# Altium project GatorSynth_Step_Sequencer.PrjPcb (part 1 of 2)
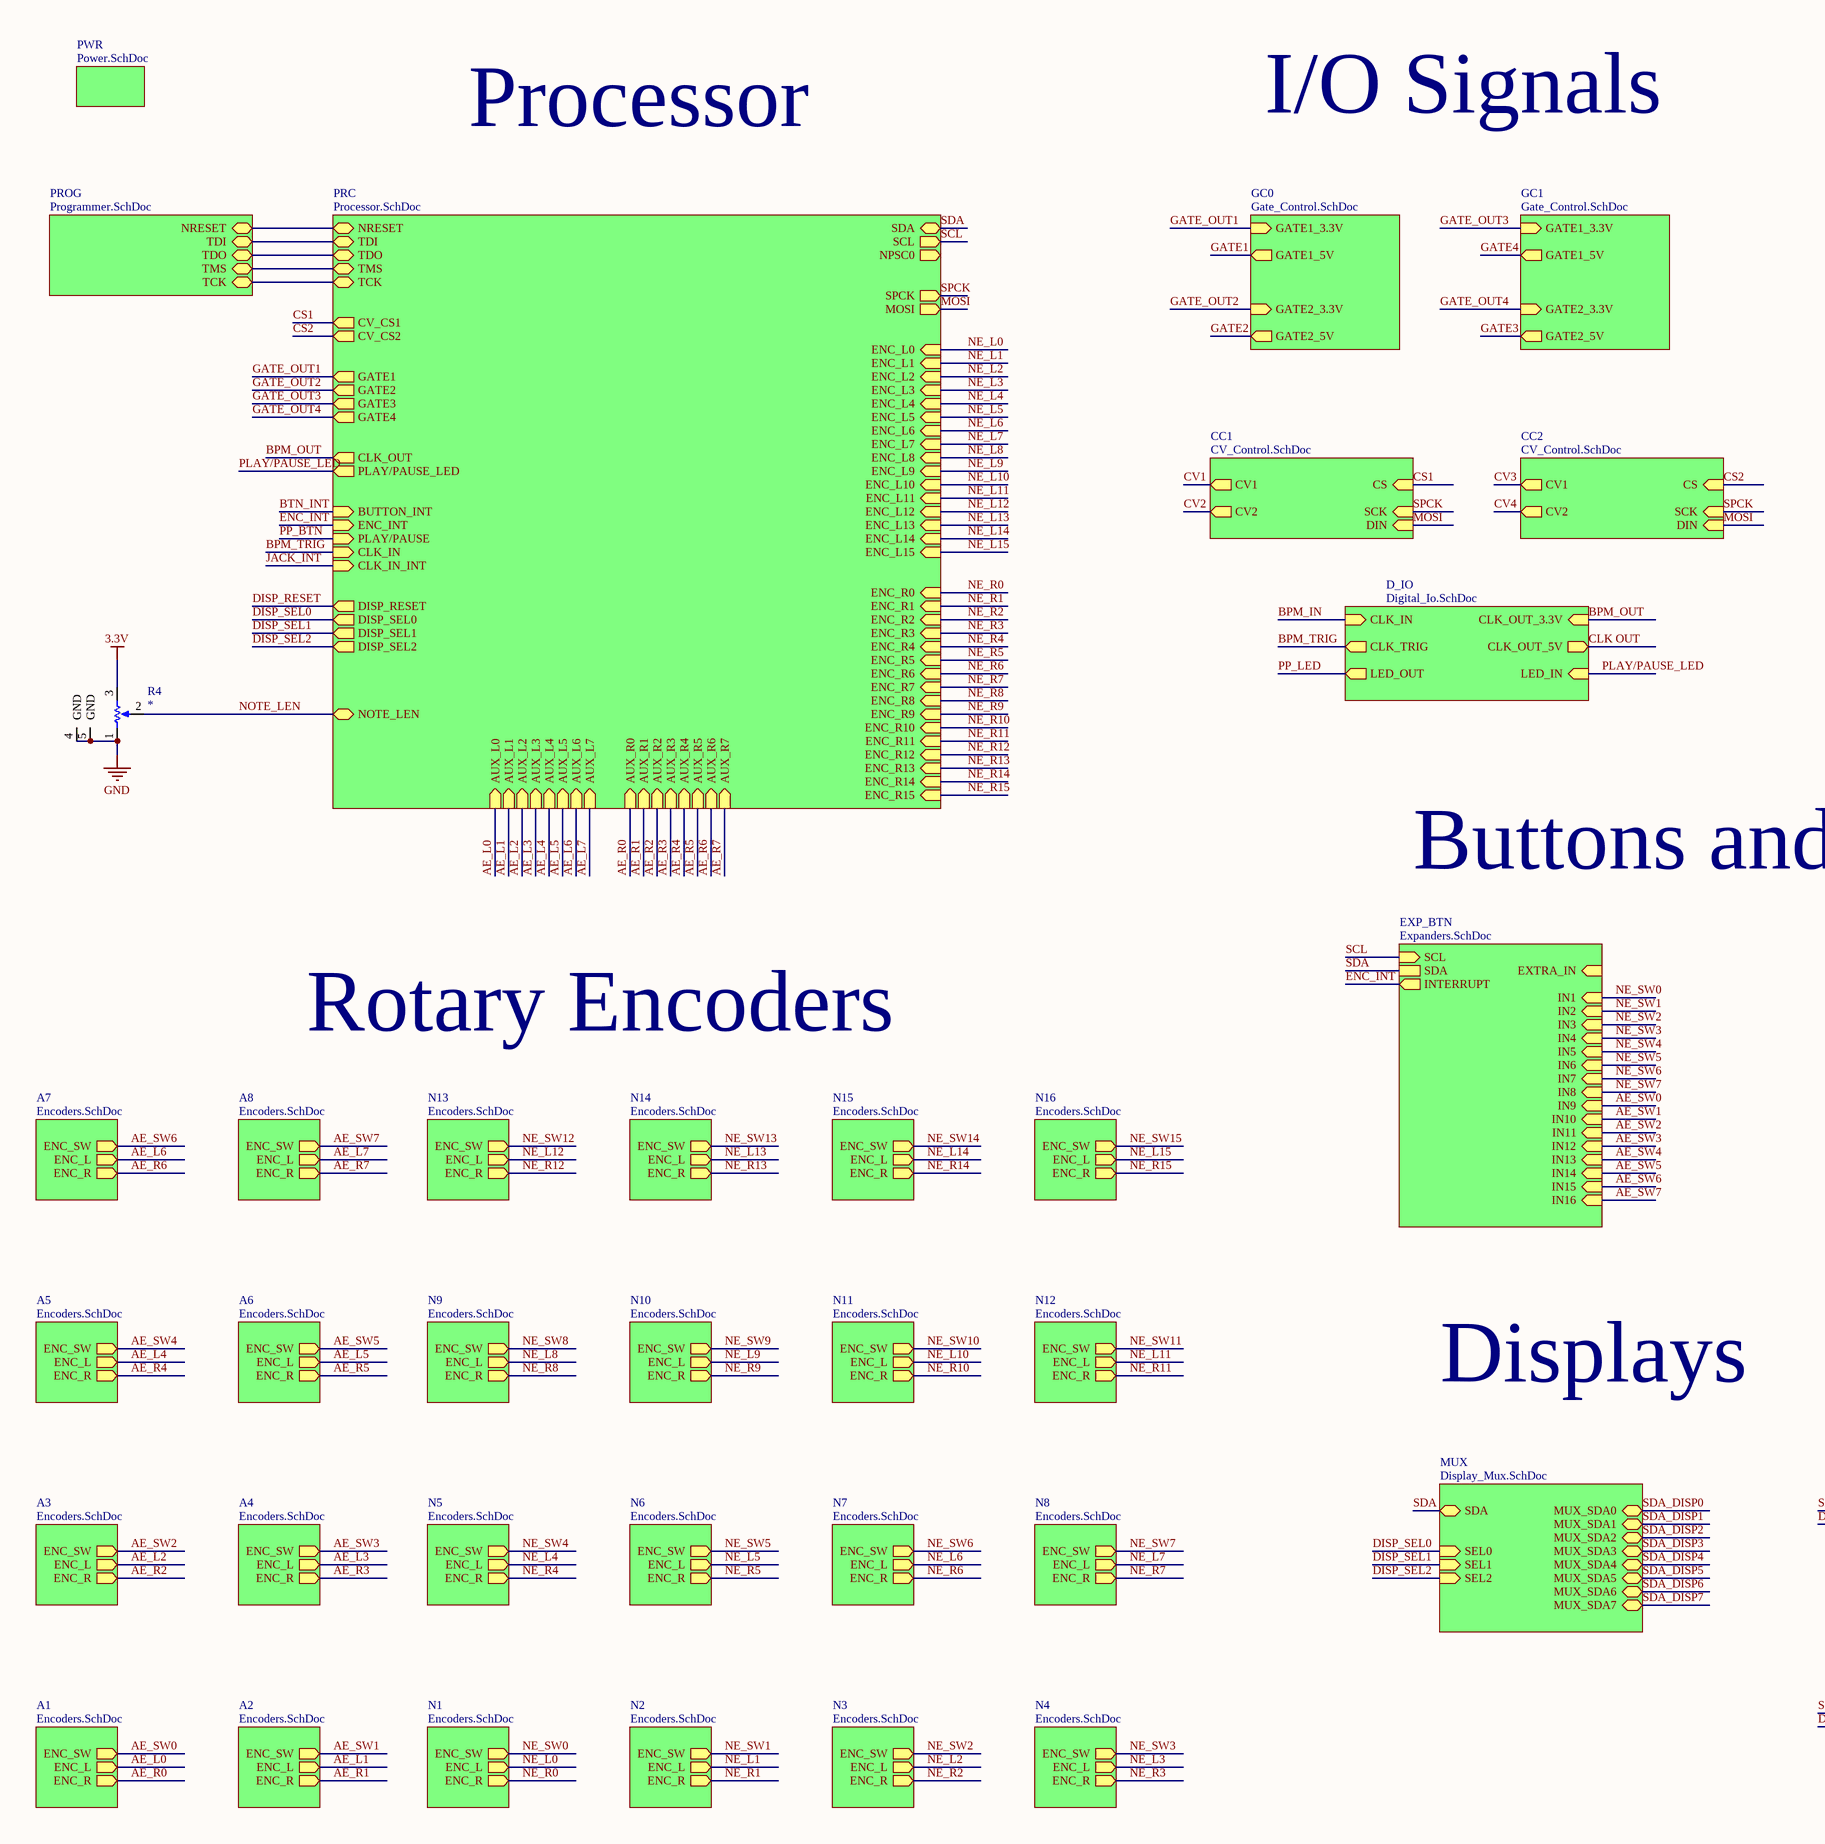
[diagram p0: Top_Level.SchDoc, left]
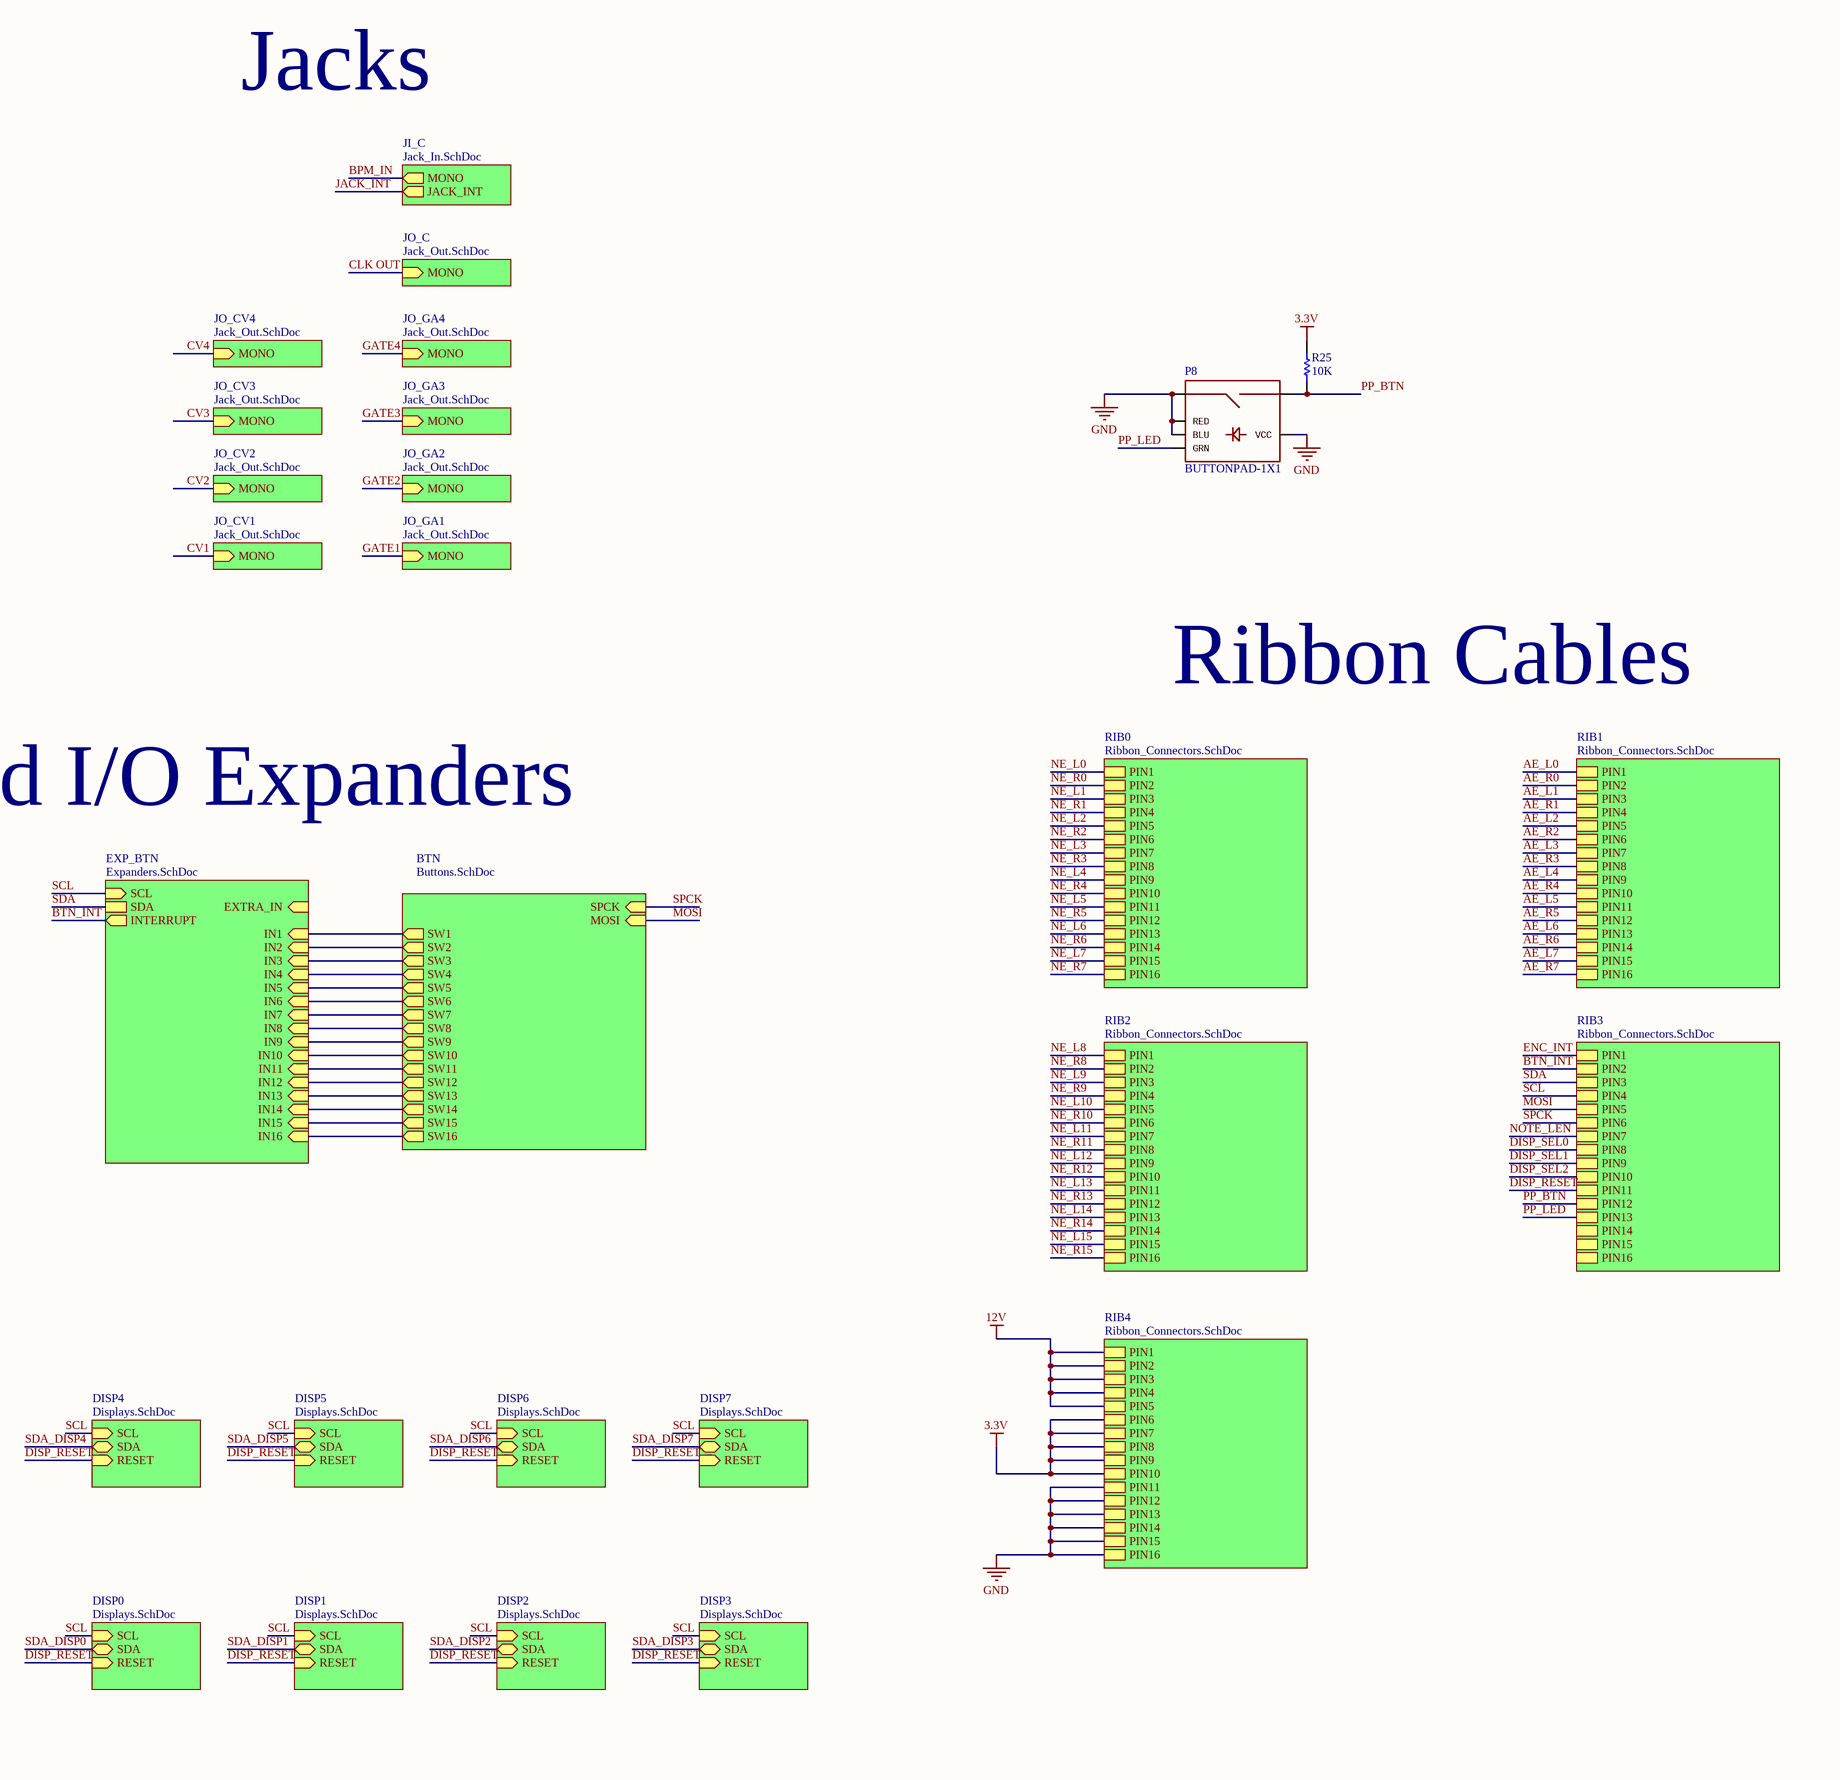
[diagram p1: Top_Level.SchDoc, right]
11 sheets, 296 parts. Net scope: hierarchical (ports join the sheet entries above them; power ports are global).
Board file: Gatorsynth_Sequencer.PcbDoc
Sheets:
  Top_Level.SchDoc
    GC1 = Gate_Control.SchDoc
    PRC = Processor.SchDoc
    JI_C = Jack_In.SchDoc
    D_IO = Digital_Io.SchDoc
    EXP_BTN = Expanders.SchDoc
    EXP_BTN = Expanders.SchDoc
    PWR = Power.SchDoc
    GC0 = Gate_Control.SchDoc
    CC1 = CV_Control.SchDoc
    CC2 = CV_Control.SchDoc
    RIB0 = Ribbon_Connectors.SchDoc
    RIB2 = Ribbon_Connectors.SchDoc
    RIB1 = Ribbon_Connectors.SchDoc
    RIB3 = Ribbon_Connectors.SchDoc
    RIB4 = Ribbon_Connectors.SchDoc
    DISP0 = Displays.SchDoc
    DISP1 = Displays.SchDoc
    DISP2 = Displays.SchDoc
    DISP3 = Displays.SchDoc
    DISP4 = Displays.SchDoc
    DISP5 = Displays.SchDoc
    DISP6 = Displays.SchDoc
    DISP7 = Displays.SchDoc
    A1 = Encoders.SchDoc
    A2 = Encoders.SchDoc
    A3 = Encoders.SchDoc
    A4 = Encoders.SchDoc
    A5 = Encoders.SchDoc
    A6 = Encoders.SchDoc
    A7 = Encoders.SchDoc
    A8 = Encoders.SchDoc
    N1 = Encoders.SchDoc
    N2 = Encoders.SchDoc
    N3 = Encoders.SchDoc
    N4 = Encoders.SchDoc
    N5 = Encoders.SchDoc
    N6 = Encoders.SchDoc
    N7 = Encoders.SchDoc
    N8 = Encoders.SchDoc
    N9 = Encoders.SchDoc
    N10 = Encoders.SchDoc
    N11 = Encoders.SchDoc
    N12 = Encoders.SchDoc
    N13 = Encoders.SchDoc
    N14 = Encoders.SchDoc
    N15 = Encoders.SchDoc
    N16 = Encoders.SchDoc

## Sheet Top_Level.SchDoc
size D

### Parts
P8  BUTTONPAD-1X1  [BUTTONPAD-1X1]
R4  *  [Potentiometer (NO SLOT)]
R25  value 10K  [AXIAL-0.3]  (hidden comment: R3)

### Sub-sheets
A1 = Encoders.SchDoc: ENC_SW (out), ENC_L (out), ENC_R (out)
A2 = Encoders.SchDoc: ENC_SW (out), ENC_L (out), ENC_R (out)
A3 = Encoders.SchDoc: ENC_SW (out), ENC_L (out), ENC_R (out)
A4 = Encoders.SchDoc: ENC_SW (out), ENC_L (out), ENC_R (out)
A5 = Encoders.SchDoc: ENC_SW (out), ENC_L (out), ENC_R (out)
A6 = Encoders.SchDoc: ENC_SW (out), ENC_L (out), ENC_R (out)
A7 = Encoders.SchDoc: ENC_SW (out), ENC_L (out), ENC_R (out)
A8 = Encoders.SchDoc: ENC_SW (out), ENC_L (out), ENC_R (out)
BTN = Buttons.SchDoc (file not in this document): SPCK (in), MOSI (in), SW1 (out), SW2 (out), SW3 (out), SW4 (out), SW5 (out), SW6 (out), SW7 (out), SW8 (out), SW9 (out), SW10 (out), SW11 (out), SW12 (out), SW13 (out), SW14 (out), SW15 (out), SW16 (out)
CC1 = CV_Control.SchDoc: CS (in), SCK (in), DIN (in), CV1 (out), CV2 (out)
CC2 = CV_Control.SchDoc: CS (in), SCK (in), DIN (in), CV1 (out), CV2 (out)
D_IO = Digital_Io.SchDoc: CLK_IN (in), CLK_TRIG (out), LED_IN (in), CLK_OUT_3.3V (in), CLK_OUT_5V (out), LED_OUT (out)
DISP0 = Displays.SchDoc: SCL (in), SDA (bidir), RESET (in)
DISP1 = Displays.SchDoc: SCL (in), SDA (bidir), RESET (in)
DISP2 = Displays.SchDoc: SCL (in), SDA (bidir), RESET (in)
DISP3 = Displays.SchDoc: SCL (in), SDA (bidir), RESET (in)
DISP4 = Displays.SchDoc: SCL (in), SDA (bidir), RESET (in)
DISP5 = Displays.SchDoc: SCL (in), SDA (bidir), RESET (in)
DISP6 = Displays.SchDoc: SCL (in), SDA (bidir), RESET (in)
DISP7 = Displays.SchDoc: SCL (in), SDA (bidir), RESET (in)
EXP_BTN = Expanders.SchDoc: SCL (in), SDA, EXTRA_IN (in), INTERRUPT (out), IN1 (in), IN2 (in), IN3 (in), IN4 (in), IN5 (in), IN6 (in), IN7 (in), IN8 (in), IN9 (in), IN10 (in), IN11 (in), IN12 (in), IN13 (in), IN14 (in), IN15 (in), IN16 (in)
EXP_BTN = Expanders.SchDoc: SCL (in), SDA, EXTRA_IN (in), INTERRUPT (out), IN1 (in), IN2 (in), IN3 (in), IN4 (in), IN5 (in), IN6 (in), IN7 (in), IN8 (in), IN9 (in), IN10 (in), IN11 (in), IN12 (in), IN13 (in), IN14 (in), IN15 (in), IN16 (in)
GC0 = Gate_Control.SchDoc: GATE1_3.3V (in), GATE2_3.3V (in), GATE1_5V (out), GATE2_5V (out)
GC1 = Gate_Control.SchDoc: GATE1_3.3V (in), GATE2_3.3V (in), GATE1_5V (out), GATE2_5V (out)
JI_C = Jack_In.SchDoc: MONO (out), JACK_INT (out)
JO_C = Jack_Out.SchDoc (file not in this document): MONO (in)
JO_CV1 = Jack_Out.SchDoc (file not in this document): MONO (in)
JO_CV2 = Jack_Out.SchDoc (file not in this document): MONO (in)
JO_CV3 = Jack_Out.SchDoc (file not in this document): MONO (in)
JO_CV4 = Jack_Out.SchDoc (file not in this document): MONO (in)
JO_GA1 = Jack_Out.SchDoc (file not in this document): MONO (in)
JO_GA2 = Jack_Out.SchDoc (file not in this document): MONO (in)
JO_GA3 = Jack_Out.SchDoc (file not in this document): MONO (in)
JO_GA4 = Jack_Out.SchDoc (file not in this document): MONO (in)
MUX = Display_Mux.SchDoc (file not in this document): SEL1 (in), SEL2 (in), MUX_SDA0 (bidir), MUX_SDA1 (bidir), MUX_SDA2 (bidir), MUX_SDA3 (bidir), MUX_SDA4 (bidir), MUX_SDA5 (bidir), MUX_SDA6 (bidir), MUX_SDA7 (bidir), SDA (bidir), SEL0 (in)
N1 = Encoders.SchDoc: ENC_SW (out), ENC_L (out), ENC_R (out)
N2 = Encoders.SchDoc: ENC_SW (out), ENC_L (out), ENC_R (out)
N3 = Encoders.SchDoc: ENC_SW (out), ENC_L (out), ENC_R (out)
N4 = Encoders.SchDoc: ENC_SW (out), ENC_L (out), ENC_R (out)
N5 = Encoders.SchDoc: ENC_SW (out), ENC_L (out), ENC_R (out)
N6 = Encoders.SchDoc: ENC_SW (out), ENC_L (out), ENC_R (out)
N7 = Encoders.SchDoc: ENC_SW (out), ENC_L (out), ENC_R (out)
N8 = Encoders.SchDoc: ENC_SW (out), ENC_L (out), ENC_R (out)
N9 = Encoders.SchDoc: ENC_SW (out), ENC_L (out), ENC_R (out)
N10 = Encoders.SchDoc: ENC_SW (out), ENC_L (out), ENC_R (out)
N11 = Encoders.SchDoc: ENC_SW (out), ENC_L (out), ENC_R (out)
N12 = Encoders.SchDoc: ENC_SW (out), ENC_L (out), ENC_R (out)
N13 = Encoders.SchDoc: ENC_SW (out), ENC_L (out), ENC_R (out)
N14 = Encoders.SchDoc: ENC_SW (out), ENC_L (out), ENC_R (out)
N15 = Encoders.SchDoc: ENC_SW (out), ENC_L (out), ENC_R (out)
N16 = Encoders.SchDoc: ENC_SW (out), ENC_L (out), ENC_R (out)
PRC = Processor.SchDoc: MOSI (out), SPCK (out), NPSC0 (out), SDA (bidir), SCL (out), NRESET (bidir), TDI (bidir), TDO (bidir), TMS (bidir), TCK (bidir), GATE1 (out), GATE2 (out), GATE3 (out), GATE4 (out), BUTTON_INT (in), ENC_INT (in), PLAY/PAUSE (in), CLK_IN (in), CLK_IN_INT (in), CLK_OUT (out), DISP_RESET (out), PLAY/PAUSE_LED (out), CV_CS2 (out), CV_CS1 (out), AUX_L0 (in), AUX_L1 (in), AUX_L2 (in), AUX_L3 (in), AUX_L4 (in), AUX_L5 (in), AUX_L6 (in), AUX_L7 (in), AUX_R0 (in), AUX_R1 (in), AUX_R2 (in), AUX_R3 (in), AUX_R4 (in), AUX_R5 (in), AUX_R6 (in), AUX_R7 (in), DISP_SEL0 (out), DISP_SEL1 (out), DISP_SEL2 (out), ENC_L0 (in), ENC_L1 (in), ENC_L2 (in), ENC_L3 (in), ENC_L4 (in), ENC_L5 (in), ENC_L6 (in), ENC_L7 (in), ENC_L8 (in), ENC_L9 (in), ENC_L10 (in), ENC_L11 (in), ENC_L12 (in), ENC_L13 (in), ENC_L14 (in), ENC_L15 (in), ENC_R0 (in), ENC_R1 (in), ENC_R2 (in), ENC_R3 (in), ENC_R4 (in), ENC_R5 (in), ENC_R6 (in), ENC_R7 (in), ENC_R8 (in), ENC_R9 (in), ENC_R10 (in), ENC_R11 (in), ENC_R12 (in), ENC_R13 (in), ENC_R14 (in), ENC_R15 (in), NOTE_LEN
PROG = Programmer.SchDoc (file not in this document): TMS (bidir), TCK (bidir), TDO (bidir), TDI (bidir), NRESET (bidir)
PWR = Power.SchDoc: no entries
RIB0 = Ribbon_Connectors.SchDoc: PIN1, PIN2, PIN3, PIN4, PIN5, PIN6, PIN7, PIN8, PIN9, PIN10, PIN11, PIN12, PIN13, PIN14, PIN15, PIN16
RIB1 = Ribbon_Connectors.SchDoc: PIN1, PIN2, PIN3, PIN4, PIN5, PIN6, PIN7, PIN8, PIN9, PIN10, PIN11, PIN12, PIN13, PIN14, PIN15, PIN16
RIB2 = Ribbon_Connectors.SchDoc: PIN1, PIN2, PIN3, PIN4, PIN5, PIN6, PIN7, PIN8, PIN9, PIN10, PIN11, PIN12, PIN13, PIN14, PIN15, PIN16
RIB3 = Ribbon_Connectors.SchDoc: PIN1, PIN2, PIN3, PIN4, PIN5, PIN6, PIN7, PIN8, PIN9, PIN10, PIN11, PIN12, PIN13, PIN14, PIN15, PIN16
RIB4 = Ribbon_Connectors.SchDoc: PIN1, PIN2, PIN3, PIN4, PIN5, PIN6, PIN7, PIN8, PIN9, PIN10, PIN11, PIN12, PIN13, PIN14, PIN15, PIN16

### Nets
3.3V: R4.3(BOT) R25.2 ; sheet RIB4/PIN6, sheet RIB4/PIN7, sheet RIB4/PIN8, sheet RIB4/PIN9, sheet RIB4/PIN10
12V: sheet RIB4/PIN1, sheet RIB4/PIN2, sheet RIB4/PIN3, sheet RIB4/PIN4, sheet RIB4/PIN5
GND: P8.BLU1(BLU) P8.RED1(RED) P8.SIG1 P8.VCC1(VCC) R4.1(TOP) R4.4(GND) R4.5(GND) ; sheet RIB4/PIN11, sheet RIB4/PIN12, sheet RIB4/PIN13, sheet RIB4/PIN14, sheet RIB4/PIN15, sheet RIB4/PIN16
AE_L0: sheet PRC/AUX_L0, sheet RIB1/PIN1, sheet A1/ENC_L
AE_L1: sheet PRC/AUX_L1, sheet RIB1/PIN3, sheet A2/ENC_L
AE_L2: sheet PRC/AUX_L2, sheet RIB1/PIN5, sheet A3/ENC_L
AE_L3: sheet PRC/AUX_L3, sheet RIB1/PIN7, sheet A4/ENC_L
AE_L4: sheet PRC/AUX_L4, sheet RIB1/PIN9, sheet A5/ENC_L
AE_L5: sheet PRC/AUX_L5, sheet RIB1/PIN11, sheet A6/ENC_L
AE_L6: sheet PRC/AUX_L6, sheet RIB1/PIN13, sheet A7/ENC_L
AE_L7: sheet PRC/AUX_L7, sheet RIB1/PIN15, sheet A8/ENC_L
AE_R0: sheet PRC/AUX_R0, sheet RIB1/PIN2, sheet A1/ENC_R
AE_R1: sheet PRC/AUX_R1, sheet RIB1/PIN4, sheet A2/ENC_R
AE_R2: sheet PRC/AUX_R2, sheet RIB1/PIN6, sheet A3/ENC_R
AE_R3: sheet PRC/AUX_R3, sheet RIB1/PIN8, sheet A4/ENC_R
AE_R4: sheet PRC/AUX_R4, sheet RIB1/PIN10, sheet A5/ENC_R
AE_R5: sheet PRC/AUX_R5, sheet RIB1/PIN12, sheet A6/ENC_R
AE_R6: sheet PRC/AUX_R6, sheet RIB1/PIN14, sheet A7/ENC_R
AE_R7: sheet PRC/AUX_R7, sheet RIB1/PIN16, sheet A8/ENC_R
AE_SW0: sheet EXP_BTN/IN9, sheet A1/ENC_SW
AE_SW1: sheet EXP_BTN/IN10, sheet A2/ENC_SW
AE_SW2: sheet EXP_BTN/IN11, sheet A3/ENC_SW
AE_SW3: sheet EXP_BTN/IN12, sheet A4/ENC_SW
AE_SW4: sheet EXP_BTN/IN13, sheet A5/ENC_SW
AE_SW5: sheet EXP_BTN/IN14, sheet A6/ENC_SW
AE_SW6: sheet EXP_BTN/IN15, sheet A7/ENC_SW
AE_SW7: sheet EXP_BTN/IN16, sheet A8/ENC_SW
BPM_IN: sheet JI_C/MONO, sheet D_IO/CLK_IN
BPM_OUT: sheet PRC/CLK_OUT, sheet D_IO/CLK_OUT_3.3V
BPM_TRIG: sheet PRC/CLK_IN, sheet D_IO/CLK_TRIG
BTN_INT: sheet PRC/BUTTON_INT, sheet EXP_BTN/INTERRUPT, sheet RIB3/PIN2
CLK OUT: sheet D_IO/CLK_OUT_5V, sheet JO_C/MONO
CS1: sheet PRC/CV_CS1, sheet CC1/CS
CS2: sheet PRC/CV_CS2, sheet CC2/CS
CV1: sheet CC1/CV1, sheet JO_CV1/MONO
CV2: sheet CC1/CV2, sheet JO_CV2/MONO
CV3: sheet CC2/CV1, sheet JO_CV3/MONO
CV4: sheet CC2/CV2, sheet JO_CV4/MONO
DISP_RESET: sheet PRC/DISP_RESET, sheet RIB3/PIN11, sheet DISP0/RESET, sheet DISP1/RESET, sheet DISP2/RESET, sheet DISP3/RESET, sheet DISP4/RESET, sheet DISP5/RESET, sheet DISP6/RESET, sheet DISP7/RESET
DISP_SEL0: sheet PRC/DISP_SEL0, sheet MUX/SEL0, sheet RIB3/PIN8
DISP_SEL1: sheet PRC/DISP_SEL1, sheet MUX/SEL1, sheet RIB3/PIN9
DISP_SEL2: sheet PRC/DISP_SEL2, sheet MUX/SEL2, sheet RIB3/PIN10
ENC_INT: sheet PRC/ENC_INT, sheet EXP_BTN/INTERRUPT, sheet RIB3/PIN1
GATE1: sheet GC0/GATE1_5V, sheet JO_GA1/MONO
GATE2: sheet GC0/GATE2_5V, sheet JO_GA2/MONO
GATE3: sheet GC1/GATE2_5V, sheet JO_GA3/MONO
GATE4: sheet GC1/GATE1_5V, sheet JO_GA4/MONO
GATE_OUT1: sheet PRC/GATE1, sheet GC0/GATE1_3.3V
GATE_OUT2: sheet PRC/GATE2, sheet GC0/GATE2_3.3V
GATE_OUT3: sheet GC1/GATE1_3.3V, sheet PRC/GATE3
GATE_OUT4: sheet GC1/GATE2_3.3V, sheet PRC/GATE4
JACK_INT: sheet PRC/CLK_IN_INT, sheet JI_C/JACK_INT
MOSI: sheet PRC/MOSI, sheet BTN/MOSI, sheet CC1/DIN, sheet CC2/DIN, sheet RIB3/PIN5
NE_L0: sheet PRC/ENC_L0, sheet RIB0/PIN1, sheet N1/ENC_L
NE_L1: sheet PRC/ENC_L1, sheet RIB0/PIN3, sheet N2/ENC_L
NE_L2: sheet PRC/ENC_L2, sheet RIB0/PIN5, sheet N3/ENC_L
NE_L3: sheet PRC/ENC_L3, sheet RIB0/PIN7, sheet N4/ENC_L
NE_L4: sheet PRC/ENC_L4, sheet RIB0/PIN9, sheet N5/ENC_L
NE_L5: sheet PRC/ENC_L5, sheet RIB0/PIN11, sheet N6/ENC_L
NE_L6: sheet PRC/ENC_L6, sheet RIB0/PIN13, sheet N7/ENC_L
NE_L7: sheet PRC/ENC_L7, sheet RIB0/PIN15, sheet N8/ENC_L
NE_L8: sheet PRC/ENC_L8, sheet RIB2/PIN1, sheet N9/ENC_L
NE_L9: sheet PRC/ENC_L9, sheet RIB2/PIN3, sheet N10/ENC_L
NE_L10: sheet PRC/ENC_L10, sheet RIB2/PIN5, sheet N11/ENC_L
NE_L11: sheet PRC/ENC_L11, sheet RIB2/PIN7, sheet N12/ENC_L
NE_L12: sheet PRC/ENC_L12, sheet RIB2/PIN9, sheet N13/ENC_L
NE_L13: sheet PRC/ENC_L13, sheet RIB2/PIN11, sheet N14/ENC_L
NE_L14: sheet PRC/ENC_L14, sheet RIB2/PIN13, sheet N15/ENC_L
NE_L15: sheet PRC/ENC_L15, sheet RIB2/PIN15, sheet N16/ENC_L
NE_R0: sheet PRC/ENC_R0, sheet RIB0/PIN2, sheet N1/ENC_R
NE_R1: sheet PRC/ENC_R1, sheet RIB0/PIN4, sheet N2/ENC_R
NE_R2: sheet PRC/ENC_R2, sheet RIB0/PIN6, sheet N3/ENC_R
NE_R3: sheet PRC/ENC_R3, sheet RIB0/PIN8, sheet N4/ENC_R
NE_R4: sheet PRC/ENC_R4, sheet RIB0/PIN10, sheet N5/ENC_R
NE_R5: sheet PRC/ENC_R5, sheet RIB0/PIN12, sheet N6/ENC_R
NE_R6: sheet PRC/ENC_R6, sheet RIB0/PIN14, sheet N7/ENC_R
NE_R7: sheet PRC/ENC_R7, sheet RIB0/PIN16, sheet N8/ENC_R
NE_R8: sheet PRC/ENC_R8, sheet RIB2/PIN2, sheet N9/ENC_R
NE_R9: sheet PRC/ENC_R9, sheet RIB2/PIN4, sheet N10/ENC_R
NE_R10: sheet PRC/ENC_R10, sheet RIB2/PIN6, sheet N11/ENC_R
NE_R11: sheet PRC/ENC_R11, sheet RIB2/PIN8, sheet N12/ENC_R
NE_R12: sheet PRC/ENC_R12, sheet RIB2/PIN10, sheet N13/ENC_R
NE_R13: sheet PRC/ENC_R13, sheet RIB2/PIN12, sheet N14/ENC_R
NE_R14: sheet PRC/ENC_R14, sheet RIB2/PIN14, sheet N15/ENC_R
NE_R15: sheet PRC/ENC_R15, sheet RIB2/PIN16, sheet N16/ENC_R
NE_SW0: sheet EXP_BTN/IN1, sheet N1/ENC_SW
NE_SW1: sheet EXP_BTN/IN2, sheet N2/ENC_SW
NE_SW2: sheet EXP_BTN/IN3, sheet N3/ENC_SW
NE_SW3: sheet EXP_BTN/IN4, sheet N4/ENC_SW
NE_SW4: sheet EXP_BTN/IN5, sheet N5/ENC_SW
NE_SW5: sheet EXP_BTN/IN6, sheet N6/ENC_SW
NE_SW6: sheet EXP_BTN/IN7, sheet N7/ENC_SW
NE_SW7: sheet EXP_BTN/IN8, sheet N8/ENC_SW
NOTE_LEN: R4.2(TAP) ; sheet PRC/NOTE_LEN, sheet RIB3/PIN7
PLAY/PAUSE_LED: sheet PRC/PLAY/PAUSE_LED, sheet D_IO/LED_IN
PP_BTN: P8.SIG2 R25.1 ; sheet PRC/PLAY/PAUSE, sheet RIB3/PIN12
PP_LED: P8.GRN1(GRN) ; sheet D_IO/LED_OUT, sheet RIB3/PIN13
SCL: sheet PRC/SCL, sheet EXP_BTN/SCL, sheet EXP_BTN/SCL, sheet RIB3/PIN4, sheet DISP0/SCL, sheet DISP1/SCL, sheet DISP2/SCL, sheet DISP3/SCL, sheet DISP4/SCL, sheet DISP5/SCL, sheet DISP6/SCL, sheet DISP7/SCL
SDA: sheet PRC/SDA, sheet EXP_BTN/SDA, sheet EXP_BTN/SDA, sheet MUX/SDA, sheet RIB3/PIN3
SDA_DISP0: sheet MUX/MUX_SDA0, sheet DISP0/SDA
SDA_DISP1: sheet MUX/MUX_SDA1, sheet DISP1/SDA
SDA_DISP2: sheet MUX/MUX_SDA2, sheet DISP2/SDA
SDA_DISP3: sheet MUX/MUX_SDA3, sheet DISP3/SDA
SDA_DISP4: sheet MUX/MUX_SDA4, sheet DISP4/SDA
SDA_DISP5: sheet MUX/MUX_SDA5, sheet DISP5/SDA
SDA_DISP6: sheet MUX/MUX_SDA6, sheet DISP6/SDA
SDA_DISP7: sheet MUX/MUX_SDA7, sheet DISP7/SDA
SPCK: sheet PRC/SPCK, sheet BTN/SPCK, sheet CC1/SCK, sheet CC2/SCK, sheet RIB3/PIN6
SW1_EXP_BTN: sheet BTN/SW1, sheet EXP_BTN/IN1
SW2_EXP_BTN: sheet BTN/SW2, sheet EXP_BTN/IN2
SW3_EXP_BTN: sheet BTN/SW3, sheet EXP_BTN/IN3
SW4_EXP_BTN: sheet BTN/SW4, sheet EXP_BTN/IN4
SW5_EXP_BTN: sheet BTN/SW5, sheet EXP_BTN/IN5
SW6_EXP_BTN: sheet BTN/SW6, sheet EXP_BTN/IN6
SW7_EXP_BTN: sheet BTN/SW7, sheet EXP_BTN/IN7
SW8_EXP_BTN: sheet BTN/SW8, sheet EXP_BTN/IN8
SW9_EXP_BTN: sheet BTN/SW9, sheet EXP_BTN/IN9
SW10_EXP_BTN: sheet BTN/SW10, sheet EXP_BTN/IN10
SW11_EXP_BTN: sheet BTN/SW11, sheet EXP_BTN/IN11
SW12_EXP_BTN: sheet BTN/SW12, sheet EXP_BTN/IN12
SW13_EXP_BTN: sheet BTN/SW13, sheet EXP_BTN/IN13
SW14_EXP_BTN: sheet BTN/SW14, sheet EXP_BTN/IN14
SW15_EXP_BTN: sheet BTN/SW15, sheet EXP_BTN/IN15
SW16_EXP_BTN: sheet BTN/SW16, sheet EXP_BTN/IN16
NetU1_51: sheet PROG/TDI, sheet PRC/TDI
NetU1_60: sheet PROG/NRESET, sheet PRC/NRESET
NetU1_76: sheet PROG/TDO, sheet PRC/TDO
NetU1_79: sheet PROG/TMS, sheet PRC/TMS
NetU1_83: sheet PROG/TCK, sheet PRC/TCK

### Notes on the sheet
- Processor
- I/O Signals
- Jacks
- Ribbon Cables
- Buttons and I/O Expanders
- Rotary Encoders
- Displays

### Library data of the parts
R4 = Potentiometer (NO_SLOTS)
R25 = Res1: Resistor; Published: 8-Jun-2000; LatestRevisionDate: 17-Jul-2002; LatestRevisionNote: Re-released for DXP Platform.; PackageReference: AXIAL-0.3; Publisher: Altium Limited; PackageDescription: Axial Device, Thru-Hole; 2 Leads; 0.3 in Pin Spacing

## Sheet Gate_Control.SchDoc
size Letter
Used 2 times, as channels GC1, GC0. Parts and nets are listed once, with the designators drawn on the sheet.
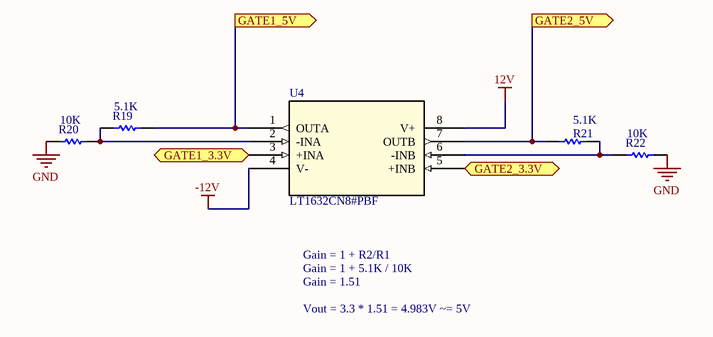
[diagram p2: Gate_Control.SchDoc]

### Parts
R19  value 5.1K  [AXIAL-0.3]  (hidden comment: Res1)
R20  value 10K  [AXIAL-0.3]  (hidden comment: Res1)
R21  value 5.1K  [AXIAL-0.3]  (hidden comment: Res1)
R22  value 10K  [AXIAL-0.3]  (hidden comment: Res1)
U4  LT1632CN8#PBF  [PDIP-8_N]

### Ports
GATE1_3.3V (in), GATE1_5V (out), GATE2_3.3V (in), GATE2_5V (out)

### Nets
12V: U4.8(V+)
-12V: U4.4(V-)
GND: R20.1 R22.2
GATE1_3.3V: U4.3(+INA) ; port GATE1_3.3V
GATE1_5V: R19.2 U4.1(OUTA) ; port GATE1_5V
GATE2_3.3V: U4.5(+INB) ; port GATE2_3.3V
GATE2_5V: R21.1 U4.7(OUTB) ; port GATE2_5V
NetR19_1: R19.1 R20.2 U4.2(-INA)
NetR21_2: R21.2 R22.1 U4.6(-INB)

### Channels
GC1: designators end in _GC1; ports GATE1_3.3V=GATE_OUT3 GATE1_5V=GATE4 GATE2_3.3V=GATE_OUT4 GATE2_5V=GATE3
GC0: designators end in _GC0; ports GATE1_3.3V=GATE_OUT1 GATE1_5V=GATE1 GATE2_3.3V=GATE_OUT2 GATE2_5V=GATE2

### Notes on the sheet
- Gain = 1 + R2/R1
- Gain = 1 + 5.1K / 10K
- Gain = 1.51
- Vout = 3.3 * 1.51 = 4.983V ~= 5V

### Library data of the parts
R19-R22 = Res1: Resistor; Published: 8-Jun-2000; LatestRevisionDate: 17-Jul-2002; LatestRevisionNote: Re-released for DXP Platform.; PackageReference: AXIAL-0.3; Publisher: Altium Limited; PackageDescription: Axial Device, Thru-Hole; 2 Leads; 0.3 in Pin Spacing
U4 = LT1632CN8#PBF: Imported; Operating_Temperature: 0Â°C ~ 70Â°C; Current_-_Output_/_Channel: 70mA; Voltage_-_Input_Offset: 500ÂµV; Current_-_Input_Bias: 1.15ÂµA; Output_Type: Rail-to-Rail; Vendor: Linear Technology; Amplifier_Type: General Purpose; Number_of_Circuits: 2; Slew_Rate: 45 V/Âµs; Gain_Bandwidth_Product: 45MHz; Current_-_Supply: 4.6mA; Current_-_Output/Channel: 40mA; Voltage_-_Supply,_Single/Dual_(Â±): 2.7 V ~ 36 V, Â±1.35 V ~ 18 V; Mounting_Type: Through Hole; 3D_Library_Name: Maxim2; C: Copyright (C) 2016 Accelerated Designs. All rights reserved; -3db_Bandwidth: -; Series: *; Manufacturer_Part_Number: LT1632CN8#PBF; DigiKeyPartNumber: LT1632CN8-ND; Quantity_Available: 0; DataSheet: http://www.linear.com/docs/3055; Packaging: Tube; Package_/_Case: 8-DIP (0.300", 7.62mm); Copyright: Copyright (C) 2015 Accelerated Designs. All rights reserved; Supplier_Device_Package: 8-PDIP; Value: Value; Type: Type; RefDes: RefDes

## Sheet Processor.SchDoc
size C
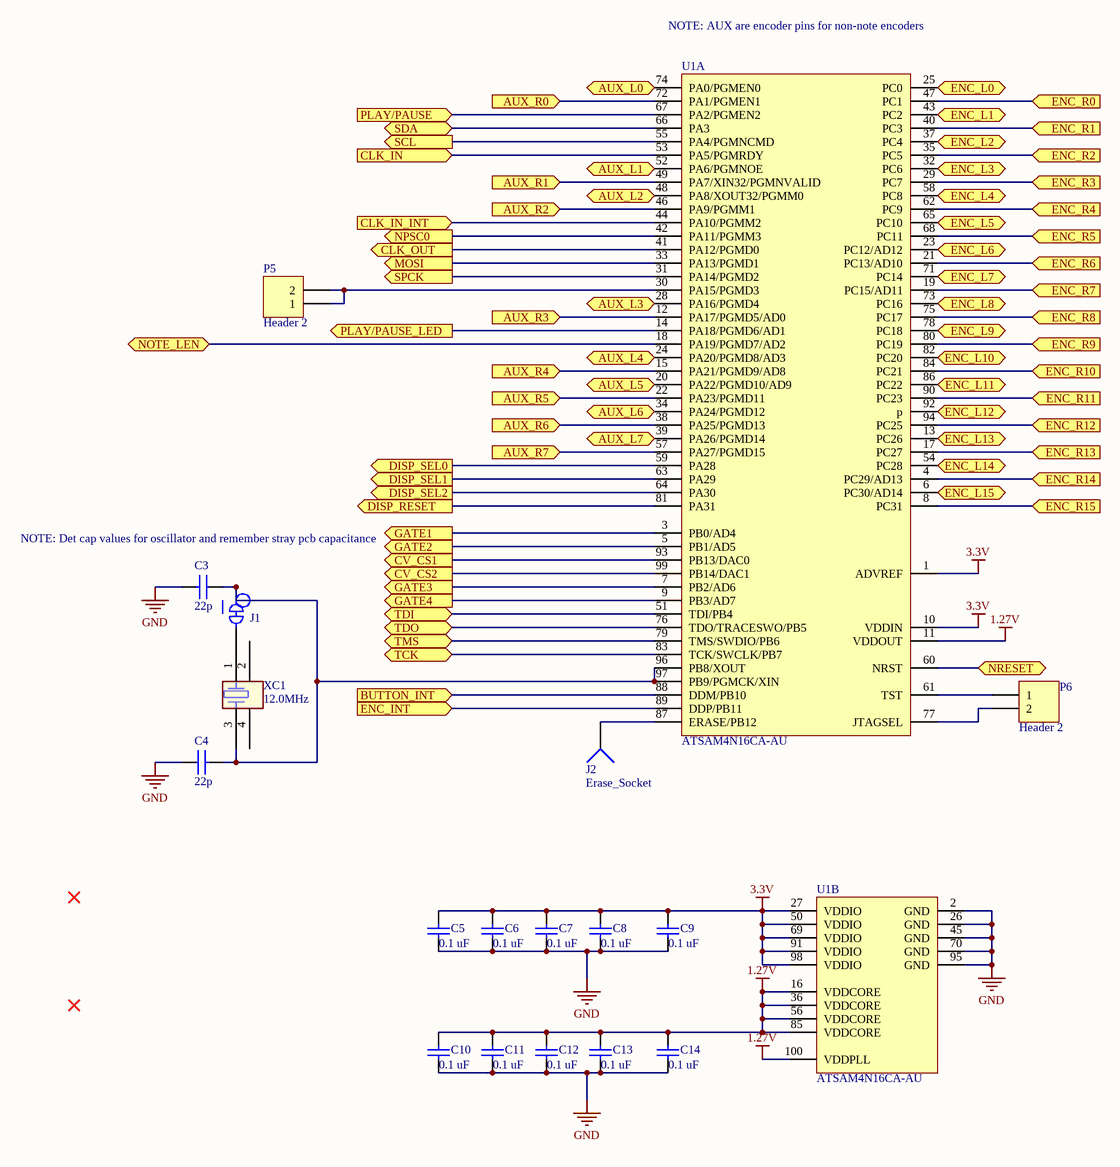
[diagram p3: Processor.SchDoc]

### Parts
C3  value 22p  [AP1-00001]  (hidden comment: CAP-NONPOL)
C4  value 22p  [AP1-00001]  (hidden comment: CAP-NONPOL)
C5  value 0.1 uF  [C0805]
C6  value 0.1 uF  [C0805]
C7  value 0.1 uF  [C0805]
C8  value 0.1 uF  [C0805]
C9  value 0.1 uF  [C0805]
C10  value 0.1 uF  [C0805]
C11  value 0.1 uF  [C0805]
C12  value 0.1 uF  [C0805]
C13  value 0.1 uF  [C0805]
C14  value 0.1 uF  [C0805]
J1  SMD-STRAP_CLOSED  [AP9-00044]  (value not drawn)  (net tie, no BOM)
J2  Erase_Socket  [PIN1]
P5  Header 2  [HDR1X2]
P6  Header 2  [HDR1X2]
U1  ATSAM4N16CA-AU  [LQFP100_N]  (parts A,B of 2)  (net tie)
XC1  12.0MHz  [AP7-00039]

### Ports
AUX_L0 (in), AUX_L1 (in), AUX_L2 (in), AUX_L3 (in), AUX_L4 (in), AUX_L5 (in), AUX_L6 (in), AUX_L7 (in), AUX_R0 (in), AUX_R1 (in), AUX_R2 (in), AUX_R3 (in), AUX_R4 (in), AUX_R5 (in), AUX_R6 (in), AUX_R7 (in), BUTTON_INT (in), CLK_IN (in), CLK_IN_INT (in), CLK_OUT (out), CV_CS1 (out), CV_CS2 (out), DISP_RESET (out), DISP_SEL0 (out), DISP_SEL1 (out), DISP_SEL2 (out), ENC_INT (in), ENC_L0 (in), ENC_L1 (in), ENC_L2 (in), ENC_L3 (in), ENC_L4 (in), ENC_L5 (in), ENC_L6 (in), ENC_L7 (in), ENC_L8 (in), ENC_L9 (in), ENC_L10 (in), ENC_L11 (in), ENC_L12 (in), ENC_L13 (in), ENC_L14 (in), ENC_L15 (in), ENC_R0 (in), ENC_R1 (in), ENC_R2 (in), ENC_R3 (in), ENC_R4 (in), ENC_R5 (in), ENC_R6 (in), ENC_R7 (in), ENC_R8 (in), ENC_R9 (in), ENC_R10 (in), ENC_R11 (in), ENC_R12 (in), ENC_R13 (in), ENC_R14 (in), ENC_R15 (in), GATE1 (out), GATE2 (out), GATE3 (out), GATE4 (out), MOSI (out), NOTE_LEN, NPSC0 (out), NRESET (bidir), PLAY/PAUSE (in), PLAY/PAUSE_LED (out), SCL (out), SDA (bidir), SPCK (out), TCK (bidir), TDI (bidir), TDO (bidir), TMS (bidir)

### Nets
1.27V: C10.2 C11.2 C12.2 C13.2 C14.2 U1.11(VDDOUT) U1.16(VDDCORE) U1.36(VDDCORE) U1.56(VDDCORE) U1.85(VDDCORE) U1.100(VDDPLL)
3.3V: C5.2 C6.2 C7.2 C8.2 C9.2 U1.1(ADVREF) U1.10(VDDIN) U1.27(VDDIO) U1.50(VDDIO) U1.69(VDDIO) U1.91(VDDIO) U1.98(VDDIO)
GND: C3.2 C4.1 C5.1 C6.1 C7.1 C8.1 C9.1 C10.1 C11.1 C12.1 C13.1 C14.1 U1.2(GND) U1.26(GND) U1.45(GND) U1.70(GND) U1.95(GND)
AE_L0: U1.74(PA0/PGMEN0) ; port AUX_L0
AE_L1: U1.52(PA6/PGMNOE) ; port AUX_L1
AE_L2: U1.48(PA8/XOUT32/PGMM0) ; port AUX_L2
AE_L3: U1.28(PA16/PGMD4) ; port AUX_L3
AE_L4: U1.24(PA20/PGMD8/AD3) ; port AUX_L4
AE_L5: U1.20(PA22/PGMD10/AD9) ; port AUX_L5
AE_L6: U1.34(PA24/PGMD12) ; port AUX_L6
AE_L7: U1.39(PA26/PGMD14) ; port AUX_L7
AE_R0: U1.72(PA1/PGMEN1) ; port AUX_R0
AE_R1: U1.49(PA7/XIN32/PGMNVALID) ; port AUX_R1
AE_R2: U1.46(PA9/PGMM1) ; port AUX_R2
AE_R3: U1.12(PA17/PGMD5/AD0) ; port AUX_R3
AE_R4: U1.15(PA21/PGMD9/AD8) ; port AUX_R4
AE_R5: U1.22(PA23/PGMD11) ; port AUX_R5
AE_R6: U1.38(PA25/PGMD13) ; port AUX_R6
AE_R7: U1.57(PA27/PGMD15) ; port AUX_R7
BPM_OUT: U1.41(PA12/PGMD0) ; port CLK_OUT
BPM_TRIG: U1.53(PA5/PGMRDY) ; port CLK_IN
BTN_INT: U1.88(DDM/PB10) ; port BUTTON_INT
CS1: U1.93(PB13/DAC0) ; port CV_CS1
CS2: U1.99(PB14/DAC1) ; port CV_CS2
DISP_RESET: U1.81(PA31) ; port DISP_RESET
DISP_SEL0: U1.59(PA28) ; port DISP_SEL0
DISP_SEL1: U1.63(PA29) ; port DISP_SEL1
DISP_SEL2: U1.64(PA30) ; port DISP_SEL2
ENC_INT: U1.89(DDP/PB11) ; port ENC_INT
GATE_OUT1: U1.3(PB0/AD4) ; port GATE1
GATE_OUT2: U1.5(PB1/AD5) ; port GATE2
GATE_OUT3: U1.7(PB2/AD6) ; port GATE3
GATE_OUT4: U1.9(PB3/AD7) ; port GATE4
JACK_INT: U1.44(PA10/PGMM2) ; port CLK_IN_INT
MOSI: U1.33(PA13/PGMD1) ; port MOSI
NE_L0: U1.25(PC0) ; port ENC_L0
NE_L1: U1.43(PC2) ; port ENC_L1
NE_L2: U1.37(PC4) ; port ENC_L2
NE_L3: U1.32(PC6) ; port ENC_L3
NE_L4: U1.58(PC8) ; port ENC_L4
NE_L5: U1.65(PC10) ; port ENC_L5
NE_L6: U1.23(PC12/AD12) ; port ENC_L6
NE_L7: U1.71(PC14) ; port ENC_L7
NE_L8: U1.73(PC16) ; port ENC_L8
NE_L9: U1.78(PC18) ; port ENC_L9
NE_L10: U1.82(PC20) ; port ENC_L10
NE_L11: U1.86(PC22) ; port ENC_L11
NE_L12: U1.92(p) ; port ENC_L12
NE_L13: U1.13(PC26) ; port ENC_L13
NE_L14: U1.54(PC28) ; port ENC_L14
NE_L15: U1.6(PC30/AD14) ; port ENC_L15
NE_R0: U1.47(PC1) ; port ENC_R0
NE_R1: U1.40(PC3) ; port ENC_R1
NE_R2: U1.35(PC5) ; port ENC_R2
NE_R3: U1.29(PC7) ; port ENC_R3
NE_R4: U1.62(PC9) ; port ENC_R4
NE_R5: U1.68(PC11) ; port ENC_R5
NE_R6: U1.21(PC13/AD10) ; port ENC_R6
NE_R7: U1.19(PC15/AD11) ; port ENC_R7
NE_R8: U1.75(PC17) ; port ENC_R8
NE_R9: U1.80(PC19) ; port ENC_R9
NE_R10: U1.84(PC21) ; port ENC_R10
NE_R11: U1.90(PC23) ; port ENC_R11
NE_R12: U1.94(PC25) ; port ENC_R12
NE_R13: U1.17(PC27) ; port ENC_R13
NE_R14: U1.4(PC29/AD13) ; port ENC_R14
NE_R15: U1.8(PC31) ; port ENC_R15
NOTE_LEN: U1.18(PA19/PGMD7/AD2) ; port NOTE_LEN
PLAY/PAUSE_LED: U1.14(PA18/PGMD6/AD1) ; port PLAY/PAUSE_LED
PP_BTN: U1.67(PA2/PGMEN2) ; port PLAY/PAUSE
SCL: U1.55(PA4/PGMNCMD) ; port SCL
SDA: U1.66(PA3) ; port SDA
SPCK: U1.31(PA14/PGMD2) ; port SPCK
NetC3_1: C3.1 C4.2 J1.1 U1.96(PB8/XOUT) U1.97(PB9/PGMCK/XIN) XC1.3
NetJ1_2: J1.2 XC1.1
NetJ2_1: J2.1 U1.87(ERASE/PB12)
NetP5_1: P5.1 P5.2 U1.30(PA15/PGMD3)
NetP6_1: P6.1 U1.61(TST)
NetP6_2: P6.2 U1.77(JTAGSEL)
NetU1_42: U1.42(PA11/PGMM3) ; port NPSC0
NetU1_51: U1.51(TDI/PB4) ; port TDI
NetU1_60: U1.60(NRST) ; port NRESET
NetU1_76: U1.76(TDO/TRACESWO/PB5) ; port TDO
NetU1_79: U1.79(TMS/SWDIO/PB6) ; port TMS
NetU1_83: U1.83(TCK/SWCLK/PB7) ; port TCK

Not connected (* = marked no-connect by the designer): XC1 2 4

### Notes on the sheet
- NOTE: AUX are encoder pins for non-note encoders
- NOTE: Det cap values for oscillator and remember stray pcb capacitance

### Library data of the parts
C3 C4 = A01-0019: Ceramic capacitor, SMD 0402, NP0, 50V, +/-5%; PartGroup: Capacitors,Ceramic,SMD 0402; TemperatureRange: -55 - +125 deg C; AN: A01-0019; Tolerance: 50V, +/-5%; Height: 0.550000011920929
C5-C14 = Cap: Capacitor; Published: 8-Jun-2000; LatestRevisionDate: 17-Jul-2002; LatestRevisionNote: Re-released for DXP Platform.; PackageReference: RAD-0.3; Publisher: Altium Limited; PackageDescription: Radial Cap, Thru-Hole; 2 Leads; 0.3 in Pin Spacing
J1 = A09-0783: Default closed SMD strap, 0603 size; PartGroup: Mechanical devices,PCB implemented components; Value: SMD-STRAP_0603_CLOSED; AN: A09-0783; Height: 0
J2 = Socket: LatestRevisionDate: 17-Jul-2002; LatestRevisionNote: Re-released for DXP Platform.; Publisher: Altium Limited
P5 P6 = Header 2: Header, 2-Pin; LatestRevisionDate: 17-Jul-2002; LatestRevisionNote: Re-released for DXP Platform.; Publisher: Altium Limited
U1 = ATSAM4S16CA-AU: AT91 ARM Cortex-M4 32-bit Microcontroller, 1MB Flash, 128KB SRAM, USB, 79 User I/Os, 100-Pin LQFP, Industrial Grade (-40°C to 105°C), Pb-Free; DatasheetVersion: revA, Oct-2011; PackageVersion: Apr-2006; PackageReference: LQFP100; PackageDescription: 100-Pin Thin Quad Flat Pack 0.5 mm Pitch; Code_JEDEC: MS-026-BED; ComponentLink1Description: Manufacturer URL; ComponentLink1URL: http://www.atmel.com/; ComponentLink2Description: SAM4S Series Datasheet; ComponentLink2URL: http://www.atmel.com/dyn/resources/prod_documents/11100.pdf; ComponentLink3Description: SAM4S Series Summary; ComponentLink3URL: http://www.atmel.com/dyn/resources/prod_documents/11100S.pdf
XC1 = A07-0042: Fox FQ5032B 12.0MHz SMD crystal 738B-12; PartGroup: Frequency devices,Crystals,SMD; Manufacturer: Fox  Electronics; MPN: FQ5032B-12-C-C-C-200-1; Tolerance: 30PPM; AN: A07-0042; Value: 12.0MHz; Height: 1,20000004768372

## Sheet Jack_In.SchDoc
size Letter
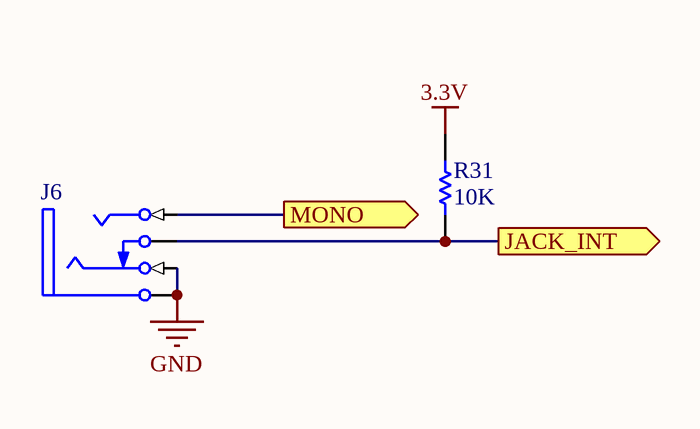
[diagram p4: Jack_In.SchDoc]

### Parts
J6  Phonejack3 RN  [MHDR1X4]  (value not drawn)
R31  value 10K  [AXIAL-0.3]  (hidden comment: Res1)

### Ports
JACK_INT (out), MONO (out)

### Nets
3.3V: R31.2
GND: J6.3(R) J6.5(S)
BPM_IN: J6.1(T) ; port MONO
JACK_INT: J6.4(RN) R31.1 ; port JACK_INT

### Library data of the parts
J6 = Phonejack3 RN: Jack Socket, 1/4" [6.5mm], Thru-Hole, Vertical, 3-Conductor with Tip open & Ring closed; PackageDocument: 2003; PCB_Layout: Complies with manufacturer's recommendation.; DrillAndSlotSize: Corresponds to nominal value.; Published: 15-Jul-2004; DatasheetDocument: 2003; PackageReference: S1VS_SBS; Publisher: Altium Limited; ComponentLink1Description: Manufacturer Link; ComponentLink1URL: http://www.cliffuk.co.uk/
R31 = Res1: Resistor; Published: 8-Jun-2000; LatestRevisionDate: 17-Jul-2002; LatestRevisionNote: Re-released for DXP Platform.; PackageReference: AXIAL-0.3; Publisher: Altium Limited; PackageDescription: Axial Device, Thru-Hole; 2 Leads; 0.3 in Pin Spacing

## Sheet Digital_Io.SchDoc
size A
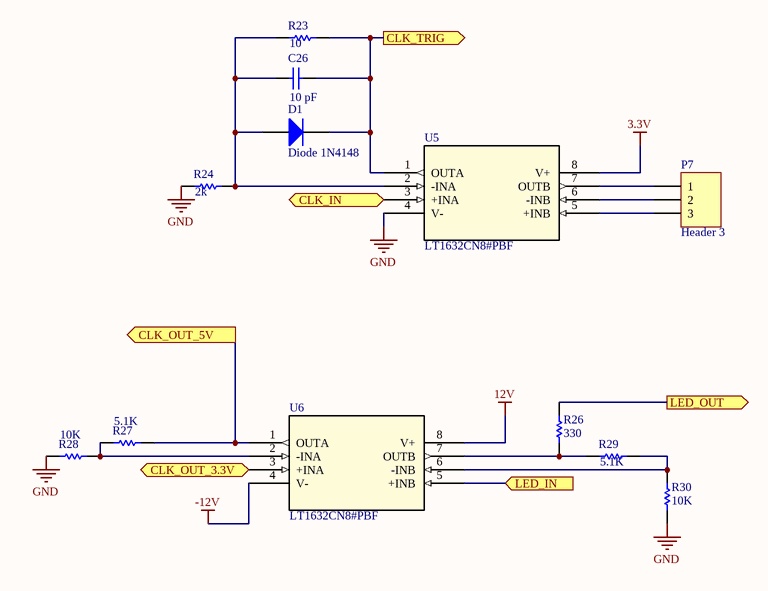
[diagram p5: Digital_Io.SchDoc]

### Parts
C26  value 10 pF  [C0805]
D1  Diode 1N4148  [DO-35]
P7  Header 3  [HDR1X3]
R23  value 10  [AXIAL-0.3]  (hidden comment: Res1)
R24  value 2k  [AXIAL-0.3]  (hidden comment: Res1)
R26  value 330  [AXIAL-0.3]  (hidden comment: Res1)
R27  value 5.1K  [AXIAL-0.3]  (hidden comment: Res1)
R28  value 10K  [AXIAL-0.3]  (hidden comment: Res1)
R29  value 5.1K  [AXIAL-0.3]  (hidden comment: Res1)
R30  value 10K  [AXIAL-0.3]  (hidden comment: Res1)
U5  LT1632CN8#PBF  [PDIP-8_N]
U6  LT1632CN8#PBF  [PDIP-8_N]

### Ports
CLK_IN (in), CLK_OUT_3.3V (in), CLK_OUT_5V (out), CLK_TRIG (out), LED_IN (in), LED_OUT (out)

### Nets
3.3V: U5.8(V+)
12V: U6.8(V+)
-12V: U6.4(V-)
GND: R24.1 R28.1 R30.1 U5.4(V-)
BPM_IN: U5.3(+INA) ; port CLK_IN
BPM_OUT: U6.3(+INA) ; port CLK_OUT_3.3V
BPM_TRIG: C26.1 D1.2(K) R23.2 U5.1(OUTA) ; port CLK_TRIG
CLK OUT: R27.2 U6.1(OUTA) ; port CLK_OUT_5V
PLAY/PAUSE_LED: U6.5(+INB) ; port LED_IN
PP_LED: R26.2 ; port LED_OUT
NetC26_2: C26.2 D1.1(A) R23.1 R24.2 U5.2(-INA)
NetP7_1: P7.1 U5.7(OUTB)
NetP7_2: P7.2 U5.6(-INB)
NetP7_3: P7.3 U5.5(+INB)
NetR26_1: R26.1 R29.1 U6.7(OUTB)
NetR27_1: R27.1 R28.2 U6.2(-INA)
NetR29_2: R29.2 R30.2 U6.6(-INB)

### Library data of the parts
C26 = Cap: Capacitor; Published: 8-Jun-2000; LatestRevisionDate: 17-Jul-2002; LatestRevisionNote: Re-released for DXP Platform.; PackageReference: RAD-0.3; Publisher: Altium Limited; PackageDescription: Radial Cap, Thru-Hole; 2 Leads; 0.3 in Pin Spacing
D1 = Diode 1N4148: High Conductance Fast Diode; Published: 8-Jun-2000; LatestRevisionDate: 17-Jul-2002; LatestRevisionNote: Re-released for DXP Platform.; DatasheetVersion: 1997; PackageReference: DO-35; Publisher: Altium Limited; PackageDescription: Diode, Axial; Body 3.8 x 1.9 mm (LxDia. max), Lead Dia. 0.53 mm (max); Code_JEDEC: DO-204-AH; ComponentLink1Description: Manufacturer Link; ComponentLink1URL: http://www.fairchildsemi.com/; ComponentLink2Description: Datasheet; ComponentLink2URL: http://www.fairchildsemi.com/ds/1N%2F1N4148.pdf
P7 = Header 3: Header, 3-Pin; LatestRevisionDate: 17-Jul-2002; LatestRevisionNote: Re-released for DXP Platform.; Publisher: Altium Limited
R23 R24 R26-R30 = Res1: Resistor; Published: 8-Jun-2000; LatestRevisionDate: 17-Jul-2002; LatestRevisionNote: Re-released for DXP Platform.; PackageReference: AXIAL-0.3; Publisher: Altium Limited; PackageDescription: Axial Device, Thru-Hole; 2 Leads; 0.3 in Pin Spacing
U5 U6 = LT1632CN8#PBF: as U4 on sheet Gate_Control; -3db_Bandwidth: -; Series: *; Manufacturer_Part_Number: LT1632CN8#PBF; DigiKeyPartNumber: LT1632CN8-ND; Quantity_Available: 0; DataSheet: http://www.linear.com/docs/3055; Packaging: Tube; Package_/_Case: 8-DIP (0.300", 7.62mm); Copyright: Copyright (C) 2015 Accelerated Designs. All rights reserved; Supplier_Device_Package: 8-PDIP; Value: Value; Type: Type; RefDes: RefDes

## Sheet Expanders.SchDoc
size A
Used 2 times, as channels EXP_BTN, EXP_BTN. Parts and nets are listed once, with the designators drawn on the sheet.
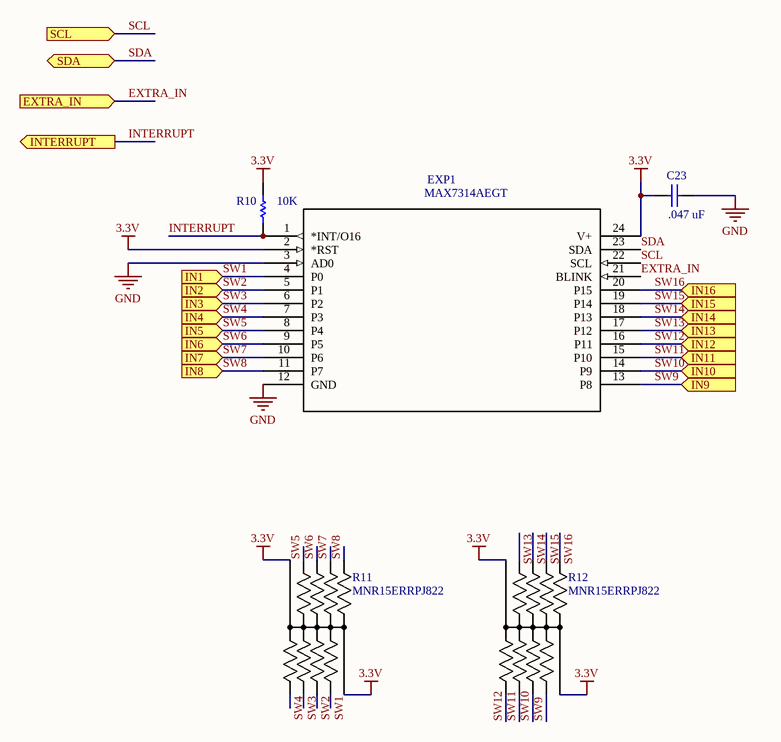
[diagram p6: Expanders.SchDoc]

### Parts
C23  value .047 uF  [C0805]  (hidden comment: Cap)
EXP1  MAX7314AEGT  [21-0055H_24]
R10  value 10K  [6-0805_N]  (hidden comment: R5)
R11  MNR15ERRPJ822  [MNR15]
R12  MNR15ERRPJ822  [MNR15]

### Ports
EXTRA_IN (in), IN1 (in), IN2 (in), IN3 (in), IN4 (in), IN5 (in), IN6 (in), IN7 (in), IN8 (in), IN9 (in), IN10 (in), IN11 (in), IN12 (in), IN13 (in), IN14 (in), IN15 (in), IN16 (in), INTERRUPT (out), SCL (in), SDA

### Nets
3.3V: C23.1 EXP1.2(*RST) EXP1.24(V+) R10.2 R11.5 R11.10 R12.5 R12.10
GND: C23.2 EXP1.3(AD0) EXP1.12(GND)
EXTRA_IN: EXP1.21(BLINK) ; port EXTRA_IN
INTERRUPT: EXP1.1(*INT/O16) R10.1 ; port INTERRUPT
SCL: EXP1.22(SCL) ; port SCL
SDA: EXP1.23(SDA) ; port SDA
SW1: EXP1.4(P0) R11.4 ; port IN1
SW2: EXP1.5(P1) R11.3 ; port IN2
SW3: EXP1.6(P2) R11.2 ; port IN3
SW4: EXP1.7(P3) R11.1 ; port IN4
SW5: EXP1.8(P4) R11.9 ; port IN5
SW6: EXP1.9(P5) R11.8 ; port IN6
SW7: EXP1.10(P6) R11.7 ; port IN7
SW8: EXP1.11(P7) R11.6 ; port IN8
SW9: EXP1.13(P8) R12.4 ; port IN9
SW10: EXP1.14(P9) R12.3 ; port IN10
SW11: EXP1.15(P10) R12.2 ; port IN11
SW12: EXP1.16(P11) R12.1 ; port IN12
SW13: EXP1.17(P12) R12.9 ; port IN13
SW14: EXP1.18(P13) R12.8 ; port IN14
SW15: EXP1.19(P14) R12.7 ; port IN15
SW16: EXP1.20(P15) R12.6 ; port IN16

### Channels
EXP_BTN: designators end in _EXP_BTN#1; ports EXTRA_IN=EXTRA_IN_EXP_BTN IN1=SW1_EXP_BTN IN2=SW2_EXP_BTN IN3=SW3_EXP_BTN IN4=SW4_EXP_BTN IN5=SW5_EXP_BTN IN6=SW6_EXP_BTN IN7=SW7_EXP_BTN IN8=SW8_EXP_BTN IN9=SW9_EXP_BTN IN10=SW10_EXP_BTN IN11=SW11_EXP_BTN IN12=SW12_EXP_BTN IN13=SW13_EXP_BTN IN14=SW14_EXP_BTN IN15=SW15_EXP_BTN IN16=SW16_EXP_BTN INTERRUPT=BTN_INT SCL=SCL SDA=SDA
EXP_BTN: designators end in _EXP_BTN#2; ports EXTRA_IN=EXTRA_IN_EXP_BTN IN1=NE_SW0 IN2=NE_SW1 IN3=NE_SW2 IN4=NE_SW3 IN5=NE_SW4 IN6=NE_SW5 IN7=NE_SW6 IN8=NE_SW7 IN9=AE_SW0 IN10=AE_SW1 IN11=AE_SW2 IN12=AE_SW3 IN13=AE_SW4 IN14=AE_SW5 IN15=AE_SW6 IN16=AE_SW7 INTERRUPT=ENC_INT SCL=SCL SDA=SDA

### Library data of the parts
C23 = Cap: Capacitor; Published: 8-Jun-2000; LatestRevisionDate: 17-Jul-2002; LatestRevisionNote: Re-released for DXP Platform.; PackageReference: RAD-0.3; Publisher: Altium Limited; PackageDescription: Radial Cap, Thru-Hole; 2 Leads; 0.3 in Pin Spacing
EXP1 = MAX7314AEGT: Interface IC - I/O extensions Maxim Integrated MAX7314AEG%2B PWM I%C2%B2C 400 kHz QSOP 24; MP: MAX7314AEG+; Availability: Bad; Price: 2.82 USD; MF: Maxim Integrated; Package: QSOP-24 Maxim Integrated; Value: *
R10 = Res1: Resistor; Published: 8-Jun-2000; LatestRevisionDate: 17-Jul-2002; LatestRevisionNote: Re-released for DXP Platform.; PackageReference: AXIAL-0.3; Publisher: Altium Limited; PackageDescription: Axial Device, Thru-Hole; 2 Leads; 0.3 in Pin Spacing
R11 R12 = MNR15ERRPJ822: Imported; Vendor: ROHM; Value: Value; Manufacturer_Part_Number: MNR15ERRPJ822

## Sheet Power.SchDoc
size A
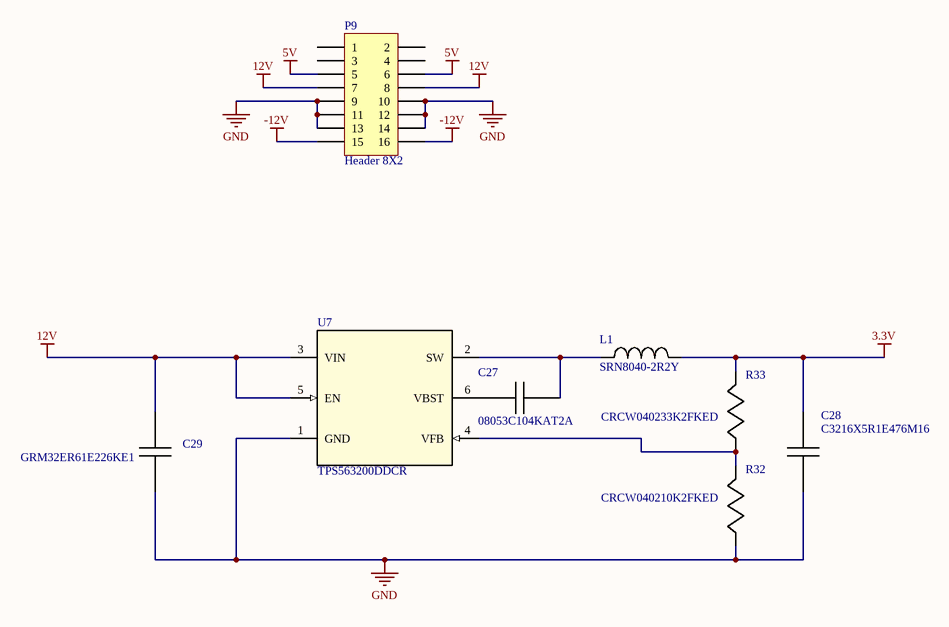
[diagram p7: Power.SchDoc]

### Parts
C27  08053C104KAT2A  [0805]
C28  C3216X5R1E476M16  [1206]
C29  GRM32ER61E226KE1  [1210]
L1  SRN8040-2R2Y  [SRN8040]
P9  Header 8X2  [HDR2X8]
R32  CRCW040210K2FKED  [0402]
R33  CRCW040233K2FKED  [0402]
U7  TPS563200DDCR  [DDC0006A]

### Nets
3.3V: C28.1 L1.2 R33.1
5V: P9.5 P9.6
12V: C29.1 P9.7 P9.8 U7.3(VIN) U7.5(EN)
-12V: P9.15 P9.16
GND: C28.2 C29.2 P9.9 P9.10 P9.11 P9.12 P9.13 P9.14 R32.2 U7.1(GND)
NetC27_1: C27.1 L1.1 U7.2(SW)
NetC27_2: C27.2 U7.6(VBST)
NetR32_1: R32.1 R33.2 U7.4(VFB)

Not connected (* = marked no-connect by the designer): P9 1 2 3 4

### Library data of the parts
C27 = 08053C104KAT2A: Imported; Vendor: AVX; Manufacturer_Part_Number: 08053C104KAT2A; Manufacturer_Name: AVX; RefDes: RefDes; TYPE: TYPE; Value: Value
C28 = C3216X5R1E476M16: Imported; Manufacturer_Part_Number: C3216X5R1E476M160AC; Manufacturer_Name: TDK; Cap_F: 0.000047; VDC_V: 25; RoHS: Y; MountType: SMT; RefDes: RefDes; TYPE: TYPE; Value: Value
C29 = GRM32ER61E226KE1: Imported; Manufacturer_Part_Number: GRM32ER61E226KE15L; Vendor: MuRata; Manufacturer_Name: MuRata; RefDes: RefDes; TYPE: TYPE; Value: Value
L1 = SRN8040-2R2Y: Imported; Vendor: Bourns; Type: DEV; Datasheet_URL: http://www.bourns.com/data/global/pdfs/SRN8040.pdf; Manufacturer_Part_Number: SRN8040-2R2Y; Manufacturer_Name: Bourns; RefDes: RefDes; Value: Value
P9 = Header 8X2: Header, 8-Pin, Dual row; LatestRevisionDate: 17-Jul-2002; LatestRevisionNote: Re-released for DXP Platform.; Publisher: Altium Limited
R32 = CRCW040210K2FKED: Imported; Vendor: Vishay-Dale; Manufacturer_Part_Number: CRCW040210K2FKED; Manufacturer_Name: Vishay-Dale; RefDes: RefDes; TYPE: TYPE; Value: Value
R33 = CRCW040233K2FKED: Imported; Vendor: Vishay-Dale; Manufacturer_Part_Number: CRCW040233K2FKED; Manufacturer_Name: Vishay-Dale; RefDes: RefDes; TYPE: TYPE; Value: Value
U7 = TPS563200DDCR: Imported; Alternate_Manufacturer: None; Manufacturer: Texas Instruments; CurrentTime: Not shown in title block; DocumentNumber: 1; SymbolCreator: a0411947; CompType: IC; U/M: EA; Designator: U?; PIN_COUNT: 6; CurrentDate: Not shown in title block; Time: Not shown in title block; Date: Not shown in title block; DocumentFullPathAndName: Not shown in title block; DocumentName: Not shown in title block; ModifiedDate: Not shown in title block; ApprovedBy: Not shown in title block; CheckedBy: Not shown in title block; Author: Not shown in title block; CompanyName: Not shown in title block; Engineer: Not shown in title block; Organization: Not shown in title block; Address1: Not shown in title block; Address2: Not shown in title block; Address3: Not shown in title block; Address4: Not shown in title block; Revision: Use project parameter SCH_Rev; SheetNumber: 1; SheetTotal: 1; ImagePath: Not shown in title block; Rule: *; ProjectName: *; SymbolVersion: 2014-04-11; PartNumber: TPS563200DDC; PackageReference: DDC0006A; MountType: SMT; ComponentLink1Description: Datasheet Link; ComponentLink1URL: https://sps06.itg.ti.com/sites/KMS/crossdivteams/altium/docs/ComponentDatasheets/TPS56320xDDC_User's_Guide_v0p1_14_0203.pdf; RoHS: Y; Publisher: Texas Instruments; LatestRevisionDate: 2014-04-14; Manufacturer_Part_Number: TPS563200DDCR; Manufacturer_Name: Texas Instruments; RefDes: RefDes; Type: DEV; Value: Value

## Sheet CV_Control.SchDoc
size Letter
Used 2 times, as channels CC1, CC2. Parts and nets are listed once, with the designators drawn on the sheet.
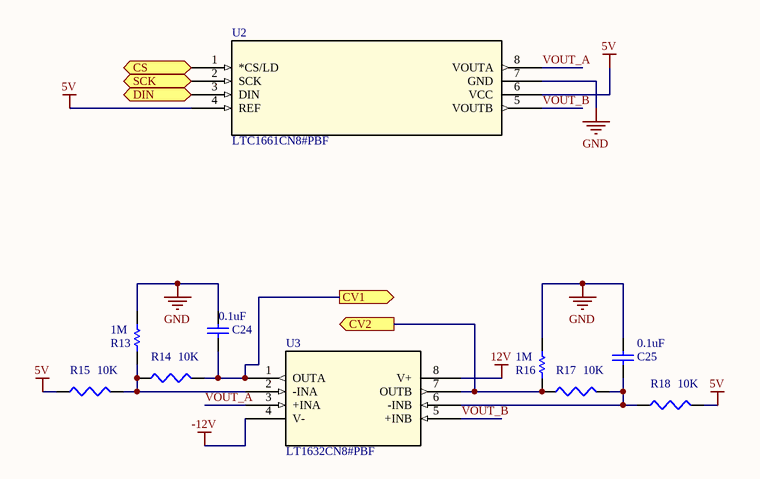
[diagram p8: CV_Control.SchDoc]

### Parts
C24  value 0.1uF  [RAD-0.3]  (hidden comment: Cap)
C25  value 0.1uF  [RAD-0.3]  (hidden comment: Cap)
R13  value 1M  [AXIAL-0.3]  (hidden comment: Res1)
R14  value 10K  [J1-0603]  (hidden comment: Res3)
R15  value 10K  [J1-0603]  (hidden comment: Res3)
R16  value 1M  [AXIAL-0.3]  (hidden comment: Res1)
R17  value 10K  [J1-0603]  (hidden comment: Res3)
R18  value 10K  [J1-0603]  (hidden comment: Res3)
U2  LTC1661CN8#PBF  [PDIP-8_N]
U3  LT1632CN8#PBF  [PDIP-8_N]

### Ports
CS (in), CV1 (out), CV2 (out), DIN (in), SCK (in)

### Nets
5V: R15.1 R18.2 U2.4(REF) U2.6(VCC)
12V: U3.8(V+)
-12V: U3.4(V-)
GND: C24.2 C25.2 R13.2 R16.2 U2.7(GND)
CS: U2.1(*CS/LD) ; port CS
CV1: C24.1 R14.2 U3.1(OUTA) ; port CV1
CV2: R16.1 R17.1 U3.7(OUTB) ; port CV2
DIN: U2.3(DIN) ; port DIN
SCK: U2.2(SCK) ; port SCK
VOUT_A: U2.8(VOUTA) U3.3(+INA)
VOUT_B: U2.5(VOUTB) U3.5(+INB)
NetC25_1: C25.1 R17.2 R18.1 U3.6(-INB)
NetR13_1: R13.1 R14.1 R15.2 U3.2(-INA)

### Channels
CC1: designators end in _CC1; ports CS=CS1 CV1=CV1 CV2=CV2 DIN=MOSI SCK=SPCK
CC2: designators end in _CC2; ports CS=CS2 CV1=CV3 CV2=CV4 DIN=MOSI SCK=SPCK

### Library data of the parts
C24 C25 = Cap: Capacitor; Published: 8-Jun-2000; LatestRevisionDate: 17-Jul-2002; LatestRevisionNote: Re-released for DXP Platform.; PackageReference: RAD-0.3; Publisher: Altium Limited; PackageDescription: Radial Cap, Thru-Hole; 2 Leads; 0.3 in Pin Spacing
R13 R16 = Res1: Resistor; Published: 8-Jun-2000; LatestRevisionDate: 17-Jul-2002; LatestRevisionNote: Re-released for DXP Platform.; PackageReference: AXIAL-0.3; Publisher: Altium Limited; PackageDescription: Axial Device, Thru-Hole; 2 Leads; 0.3 in Pin Spacing
R14 R15 R17 R18 = Res3: Resistor; Published: 8-Jun-2000; LatestRevisionDate: 29-May-2009; LatestRevisionNote: IPC-7351 Footprint Added.; PackageReference: J1-0603; Publisher: Altium Limited; PackageDescription: Chip Resistor
U2 = LTC1661CN8#PBF: Imported; Vendor: Linear Technology; Manufacturer_Part_Number: LTC1661CN8#PBF; Value: Value; Type: Type; RefDes: RefDes
U3 = LT1632CN8#PBF: as U4 on sheet Gate_Control; -3db_Bandwidth: -; Series: *; Manufacturer_Part_Number: LT1632CN8#PBF; DigiKeyPartNumber: LT1632CN8-ND; Quantity_Available: 0; DataSheet: http://www.linear.com/docs/3055; Packaging: Tube; Package_/_Case: 8-DIP (0.300", 7.62mm); Copyright: Copyright (C) 2015 Accelerated Designs. All rights reserved; Supplier_Device_Package: 8-PDIP; Value: Value; Type: Type; RefDes: RefDes

## Sheet Ribbon_Connectors.SchDoc
size Letter
Used 5 times, as channels RIB0, RIB2, RIB1, RIB3, RIB4. Parts and nets are listed once, with the designators drawn on the sheet.
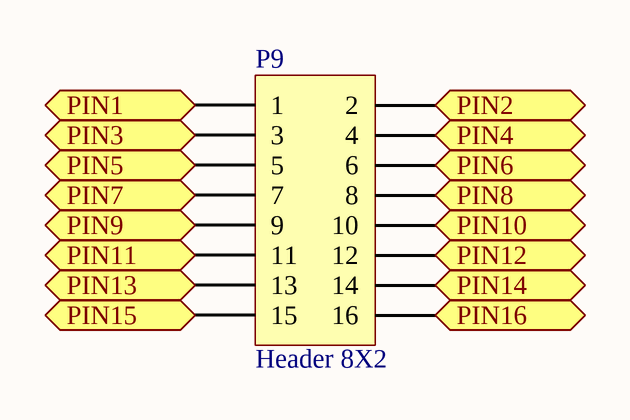
[diagram p9: Ribbon_Connectors.SchDoc]

### Parts
P9  Header 8X2  [HDR2X8]

### Ports
PIN1, PIN2, PIN3, PIN4, PIN5, PIN6, PIN7, PIN8, PIN9, PIN10, PIN11, PIN12, PIN13, PIN14, PIN15, PIN16

### Nets
PIN1: P9.1 ; port PIN1
PIN2: P9.2 ; port PIN2
PIN3: P9.3 ; port PIN3
PIN4: P9.4 ; port PIN4
PIN5: P9.5 ; port PIN5
PIN6: P9.6 ; port PIN6
PIN7: P9.7 ; port PIN7
PIN8: P9.8 ; port PIN8
PIN9: P9.9 ; port PIN9
PIN10: P9.10 ; port PIN10
PIN11: P9.11 ; port PIN11
PIN12: P9.12 ; port PIN12
PIN13: P9.13 ; port PIN13
PIN14: P9.14 ; port PIN14
PIN15: P9.15 ; port PIN15
PIN16: P9.16 ; port PIN16

### Channels
RIB0: designators end in _RIB0; ports PIN1=NE_L0 PIN2=NE_R0 PIN3=NE_L1 PIN4=NE_R1 PIN5=NE_L2 PIN6=NE_R2 PIN7=NE_L3 PIN8=NE_R3 PIN9=NE_L4 PIN10=NE_R4 PIN11=NE_L5 PIN12=NE_R5 PIN13=NE_L6 PIN14=NE_R6 PIN15=NE_L7 PIN16=NE_R7
RIB2: designators end in _RIB2; ports PIN1=NE_L8 PIN2=NE_R8 PIN3=NE_L9 PIN4=NE_R9 PIN5=NE_L10 PIN6=NE_R10 PIN7=NE_L11 PIN8=NE_R11 PIN9=NE_L12 PIN10=NE_R12 PIN11=NE_L13 PIN12=NE_R13 PIN13=NE_L14 PIN14=NE_R14 PIN15=NE_L15 PIN16=NE_R15
RIB1: designators end in _RIB1; ports PIN1=AE_L0 PIN2=AE_R0 PIN3=AE_L1 PIN4=AE_R1 PIN5=AE_L2 PIN6=AE_R2 PIN7=AE_L3 PIN8=AE_R3 PIN9=AE_L4 PIN10=AE_R4 PIN11=AE_L5 PIN12=AE_R5 PIN13=AE_L6 PIN14=AE_R6 PIN15=AE_L7 PIN16=AE_R7
RIB3: designators end in _RIB3; ports PIN1=ENC_INT PIN2=BTN_INT PIN3=SDA PIN4=SCL PIN5=MOSI PIN6=SPCK PIN7=NOTE_LEN PIN8=DISP_SEL0 PIN9=DISP_SEL1 PIN10=DISP_SEL2 PIN11=DISP_RESET PIN12=PP_BTN PIN13=PP_LED PIN14=NetP9_RIB3_14 PIN15=NetP9_RIB3_15 PIN16=NetP9_RIB3_16
RIB4: designators end in _RIB4; ports PIN1=12V PIN2=12V PIN3=12V PIN4=12V PIN5=12V PIN6=3.3V PIN7=3.3V PIN8=3.3V PIN9=3.3V PIN10=3.3V PIN11=GND PIN12=GND PIN13=GND PIN14=GND PIN15=GND PIN16=GND

### Library data of the parts
P9 = Header 8X2: Header, 8-Pin, Dual row; LatestRevisionDate: 17-Jul-2002; LatestRevisionNote: Re-released for DXP Platform.; Publisher: Altium Limited

## Sheet Displays.SchDoc
size B
Used 8 times, as channels DISP0, DISP1, DISP2, DISP3, DISP4, DISP5, DISP6, DISP7. Parts and nets are listed once, with the designators drawn on the sheet.
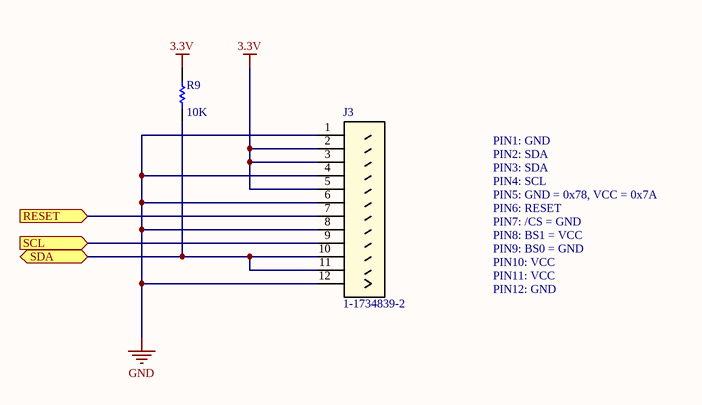
[diagram p10: Displays.SchDoc]

### Parts
J3  1-1734839-2  [CONN_1-1734592-2]
R9  value 10K  [6-0805_N]

### Ports
RESET (in), SCL (in), SDA (bidir)

### Nets
3.3V: J3.2 J3.3 J3.5 R9.1
GND: J3.1 J3.4 J3.6 J3.8 J3.12
RESET: J3.7 ; port RESET
SCL: J3.9 ; port SCL
SDA: J3.10 J3.11 R9.2 ; port SDA

### Channels
DISP0: designators end in _DISP0; ports RESET=DISP_RESET SCL=SCL SDA=SDA_DISP0
DISP1: designators end in _DISP1; ports RESET=DISP_RESET SCL=SCL SDA=SDA_DISP1
DISP2: designators end in _DISP2; ports RESET=DISP_RESET SCL=SCL SDA=SDA_DISP2
DISP3: designators end in _DISP3; ports RESET=DISP_RESET SCL=SCL SDA=SDA_DISP3
DISP4: designators end in _DISP4; ports RESET=DISP_RESET SCL=SCL SDA=SDA_DISP4
DISP5: designators end in _DISP5; ports RESET=DISP_RESET SCL=SCL SDA=SDA_DISP5
DISP6: designators end in _DISP6; ports RESET=DISP_RESET SCL=SCL SDA=SDA_DISP6
DISP7: designators end in _DISP7; ports RESET=DISP_RESET SCL=SCL SDA=SDA_DISP7

### Notes on the sheet
- PIN1: GND
- PIN2: SDA
- PIN3: SDA
- PIN4: SCL
- PIN5: GND = 0x78, VCC = 0x7A
- PIN7: /CS = GND
- PIN6: RESET
- PIN8: BS1 = VCC
- PIN9: BS0 = GND
- PIN10: VCC
- PIN11: VCC
- PIN12: GND

### Library data of the parts
J3 = 1-1734839-2: Imported; Manufacturer_Name: Tyco Electronics Amp; Vendor: Tyco Electronics; Supersection: Connectors; Section: General Purpose; C: Copyright (C) 2015 Accelerated Designs. All rights reserved; Manufacturer_Part_Number: 1-1734839-2; Family: Headers and PCB Receptacles; Copyright: Copyright (C) 2015 Accelerated Designs. All rights reserved; RS_Part_Number: 7188674; Value: Value; Type: Type; RefDes: RefDes
R9 = Res1: Resistor; Published: 8-Jun-2000; LatestRevisionDate: 17-Jul-2002; LatestRevisionNote: Re-released for DXP Platform.; PackageReference: AXIAL-0.3; Publisher: Altium Limited; PackageDescription: Axial Device, Thru-Hole; 2 Leads; 0.3 in Pin Spacing

## Sheet Encoders.SchDoc
size Letter
Used 24 times, as channels A1, A2, A3, A4, A5, A6, A7, A8, N1, N2, N3, N4, N5, N6, N7, N8, N9, N10, N11, N12, N13, N14, N15, N16. Parts and nets are listed once, with the designators drawn on the sheet.
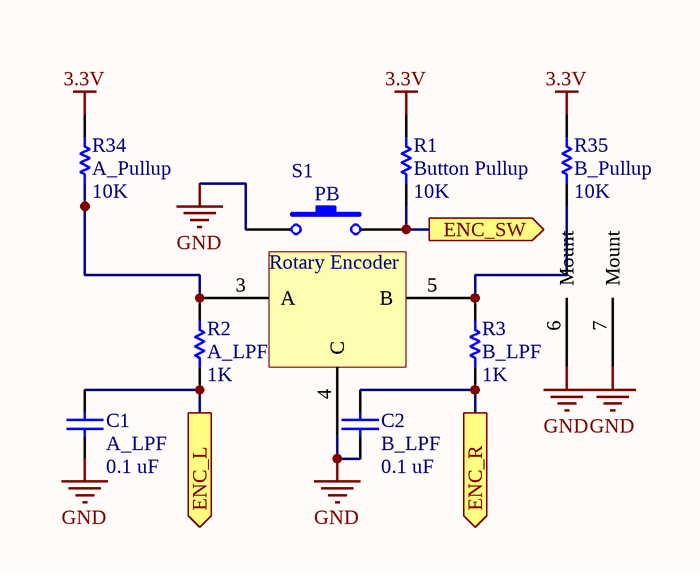
[diagram p11: Encoders.SchDoc]

### Parts
C1  A_LPF  value 0.1 uF  [C0805]
C2  B_LPF  value 0.1 uF  [C0805]
R1  Button Pullup  value 10K  [6-0805_N]
R2  A_LPF  value 1K  [6-0805_N]
R3  B_LPF  value 1K  [6-0805_N]
R34  A_Pullup  value 10K  [6-0805_N]
R35  B_Pullup  value 10K  [6-0805_N]
S1  Rotary Encoder  [Rotary Encoder SF]  (value not drawn)

### Ports
ENC_L (out), ENC_R (out), ENC_SW (out)

### Nets
3.3V: R1.1 R34.1 R35.1
GND: C1.1 C2.1 S1.1 S1.4(C) S1.6(Mount) S1.7(Mount)
ENC_L: C1.2 R2.2 ; port ENC_L
ENC_R: C2.2 R3.2 ; port ENC_R
ENC_SW: R1.2 S1.2 ; port ENC_SW
NetR2_1: R2.1 R34.2 S1.3(A)
NetR3_1: R3.1 R35.2 S1.5(B)

### Channels
A1: designators end in _A1; ports ENC_L=AE_L0 ENC_R=AE_R0 ENC_SW=AE_SW0
A2: designators end in _A2; ports ENC_L=AE_L1 ENC_R=AE_R1 ENC_SW=AE_SW1
A3: designators end in _A3; ports ENC_L=AE_L2 ENC_R=AE_R2 ENC_SW=AE_SW2
A4: designators end in _A4; ports ENC_L=AE_L3 ENC_R=AE_R3 ENC_SW=AE_SW3
A5: designators end in _A5; ports ENC_L=AE_L4 ENC_R=AE_R4 ENC_SW=AE_SW4
A6: designators end in _A6; ports ENC_L=AE_L5 ENC_R=AE_R5 ENC_SW=AE_SW5
A7: designators end in _A7; ports ENC_L=AE_L6 ENC_R=AE_R6 ENC_SW=AE_SW6
A8: designators end in _A8; ports ENC_L=AE_L7 ENC_R=AE_R7 ENC_SW=AE_SW7
N1: designators end in _N1; ports ENC_L=NE_L0 ENC_R=NE_R0 ENC_SW=NE_SW0
N2: designators end in _N2; ports ENC_L=NE_L1 ENC_R=NE_R1 ENC_SW=NE_SW1
N3: designators end in _N3; ports ENC_L=NE_L2 ENC_R=NE_R2 ENC_SW=NE_SW2
N4: designators end in _N4; ports ENC_L=NE_L3 ENC_R=NE_R3 ENC_SW=NE_SW3
N5: designators end in _N5; ports ENC_L=NE_L4 ENC_R=NE_R4 ENC_SW=NE_SW4
N6: designators end in _N6; ports ENC_L=NE_L5 ENC_R=NE_R5 ENC_SW=NE_SW5
N7: designators end in _N7; ports ENC_L=NE_L6 ENC_R=NE_R6 ENC_SW=NE_SW6
N8: designators end in _N8; ports ENC_L=NE_L7 ENC_R=NE_R7 ENC_SW=NE_SW7
N9: designators end in _N9; ports ENC_L=NE_L8 ENC_R=NE_R8 ENC_SW=NE_SW8
N10: designators end in _N10; ports ENC_L=NE_L9 ENC_R=NE_R9 ENC_SW=NE_SW9
N11: designators end in _N11; ports ENC_L=NE_L10 ENC_R=NE_R10 ENC_SW=NE_SW10
N12: designators end in _N12; ports ENC_L=NE_L11 ENC_R=NE_R11 ENC_SW=NE_SW11
N13: designators end in _N13; ports ENC_L=NE_L12 ENC_R=NE_R12 ENC_SW=NE_SW12
N14: designators end in _N14; ports ENC_L=NE_L13 ENC_R=NE_R13 ENC_SW=NE_SW13
N15: designators end in _N15; ports ENC_L=NE_L14 ENC_R=NE_R14 ENC_SW=NE_SW14
N16: designators end in _N16; ports ENC_L=NE_L15 ENC_R=NE_R15 ENC_SW=NE_SW15

### Notes on the sheet
- (in symbol Rotary Encoder) PB

### Library data of the parts
C1 C2 = Cap: Capacitor; Published: 8-Jun-2000; LatestRevisionDate: 17-Jul-2002; LatestRevisionNote: Re-released for DXP Platform.; PackageReference: RAD-0.3; Publisher: Altium Limited; PackageDescription: Radial Cap, Thru-Hole; 2 Leads; 0.3 in Pin Spacing
R1-R3 R34 R35 = Res1: Resistor; Published: 8-Jun-2000; LatestRevisionDate: 17-Jul-2002; LatestRevisionNote: Re-released for DXP Platform.; PackageReference: AXIAL-0.3; Publisher: Altium Limited; PackageDescription: Axial Device, Thru-Hole; 2 Leads; 0.3 in Pin Spacing